# EAGLE design PygmyWEB_Performance_V1p2 (EAGLE 5.10)

## Sheet 1 of 6
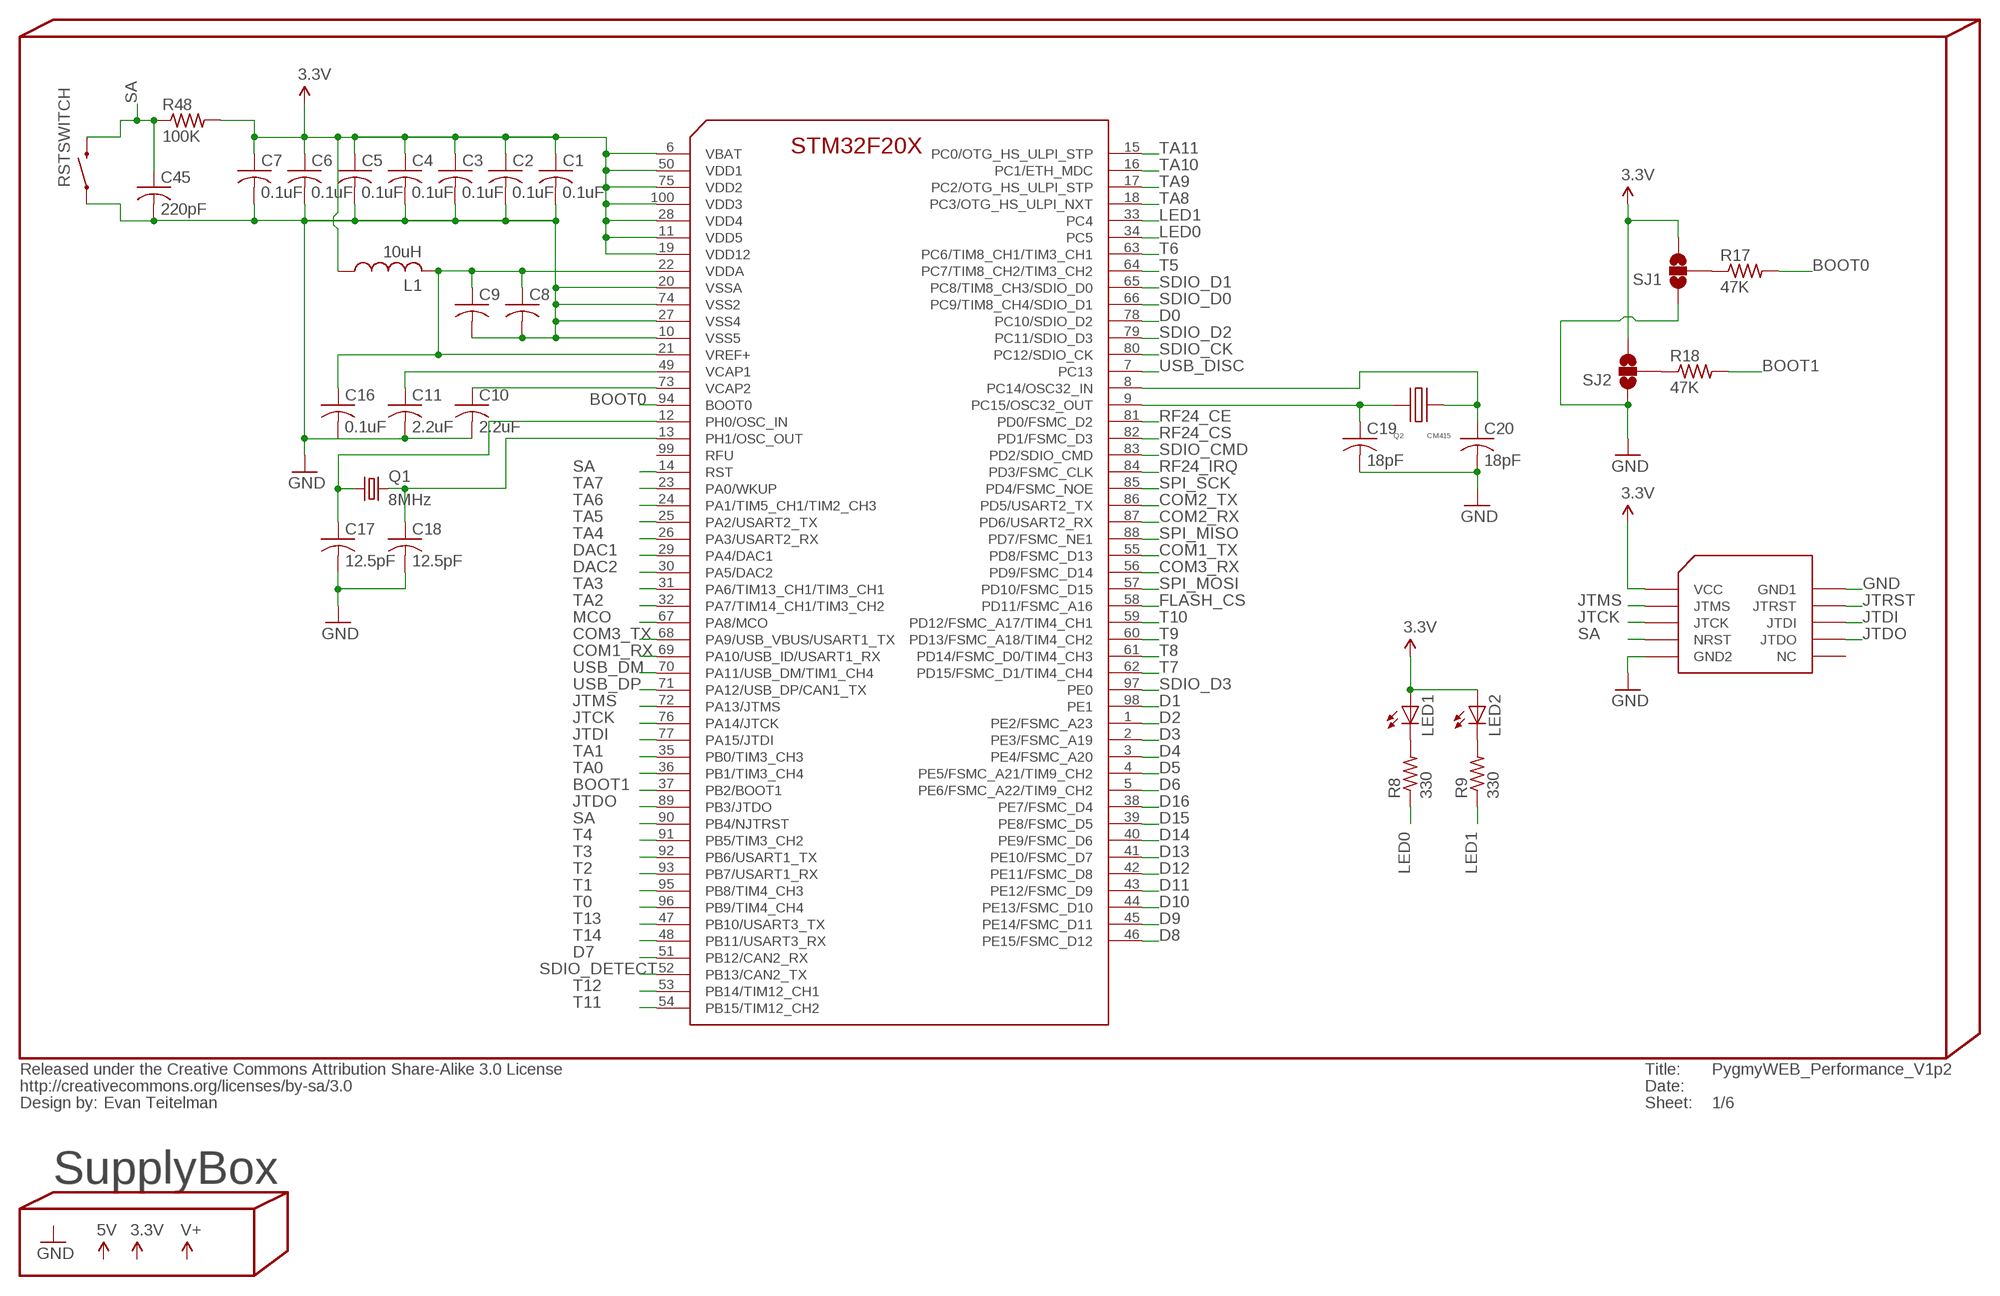
[diagram p0: schematic, sheet 1]

### Parts
C1  0.1uF  C-USC0402  [C0402]
C2  0.1uF  C-USC0402  [C0402]
C3  0.1uF  C-USC0402  [C0402]
C4  0.1uF  C-USC0402  [C0402]
C5  0.1uF  C-USC0402  [C0402]
C6  0.1uF  C-USC0402  [C0402]
C7  0.1uF  C-USC0402  [C0402]
C8  C-USC0402  [C0402]
C9  C-USC0402  [C0402]
C10  2.2uF  C-USC0402  [C0402]
C11  2.2uF  C-USC0402  [C0402]
C16  0.1uF  C-USC0402  [C0402]
C17  12.5pF  C-USC0402  [C0402]
C18  12.5pF  C-USC0402  [C0402]
C19  18pF  C-USC0402  [C0402]
C20  18pF  C-USC0402  [C0402]
C45  220pF  C-USC0402  [C0402]
CC1  Evan Teitelman  CC-BY-SA  [CC-BY-SA]
L1  10uH  L-USL1812  [L1812]
LED1  LED0603  [LED-0603]
LED2  LED0603  [LED-0603]
Q1  8MHz  CRYSTAL5X3  [CRYSTAL-SMD-5X3]
Q2  CM415  [CM415]
R8  330  R-US_R0402  [R0402]
R9  330  R-US_R0402  [R0402]
R17  47K  R-US_R0402  [R0402]
R18  47K  R-US_R0402  [R0402]
R48  100K  R-US_R0402  [R0402]
RSTSWITCH  SWITCH-MOMENTARY-2SMD  [TACTILE_SWITCH_SMD]
SJ1  SOLDERJUMPER_2WAYS  [SJ_3]
SJ2  SOLDERJUMPER_2WAYS  [SJ_3]
U1  STM32F205VG  [TQFP100]
U5  STM32-JTAG-10P  [STM32-JTAG-10P]

### Nets
3.3V: C1.1 C2.1 C3.1 C4.1 C5.1 C6.1 C7.1 L1.1 LED1.A LED2.A R48.2 SJ1.3 SJ2.3 U1.6(VBAT) U1.11(VDD5) U1.19(VDD12) U1.28(VDD4) U1.50(VDD1) U1.75(VDD2) U1.100(VDD3) U5.P$1(VCC) ; also sheet 2,3,4,5
BOOT0: R17.2 U1.94(BOOT0) ; also sheet 3
BOOT1: R18.2 U1.37(PB2/BOOT1) ; also sheet 3
COM1_RX: U1.69(PA10/USB_ID/USART1_RX) ; also sheet 3
COM1_TX: U1.55(PD8/FSMC_D13) ; also sheet 3
COM2_RX: U1.87(PD6/USART2_RX) ; also sheet 3
COM2_TX: U1.86(PD5/USART2_TX) ; also sheet 3
COM3_RX: U1.56(PD9/FSMC_D14) ; also sheet 3
COM3_TX: U1.68(PA9/USB_VBUS/USART1_TX) ; also sheet 3
D0: U1.78(PC10/SDIO_D2) ; also sheet 3
D1: U1.98(PE1) ; also sheet 3
D2: U1.1(PE2/FSMC_A23) ; also sheet 3
D3: U1.2(PE3/FSMC_A19) ; also sheet 3
D4: U1.3(PE4/FSMC_A20) ; also sheet 3
D5: U1.4(PE5/FSMC_A21/TIM9_CH2) ; also sheet 3
D6: U1.5(PE6/FSMC_A22/TIM9_CH2) ; also sheet 3
D7: U1.51(PB12/CAN2_RX) ; also sheet 3
D8: U1.46(PE15/FSMC_D12) ; also sheet 3
D9: U1.45(PE14/FSMC_D11) ; also sheet 3
D10: U1.44(PE13/FSMC_D10) ; also sheet 3
D11: U1.43(PE12/FSMC_D9) ; also sheet 3
D12: U1.42(PE11/FSMC_D8) ; also sheet 3
D13: U1.41(PE10/FSMC_D7) ; also sheet 3
D14: U1.40(PE9/FSMC_D6) ; also sheet 3
D15: U1.39(PE8/FSMC_D5) ; also sheet 3
D16: U1.38(PE7/FSMC_D4) ; also sheet 3
DAC1: U1.29(PA4/DAC1) ; also sheet 3
DAC2: U1.30(PA5/DAC2) ; also sheet 3
FLASH_CS: U1.58(PD11/FSMC_A16)
GND: C1.2 C2.2 C3.2 C4.2 C5.2 C6.2 C7.2 C8.2 C9.2 C10.2 C11.2 C16.2 C17.2 C18.2 C19.2 C20.2 C45.2 RSTSWITCH.1 SJ1.1 SJ2.1 U1.10(VSS5) U1.20(VSSA) U1.27(VSS4) U1.74(VSS2) U5.P$2(GND1) U5.P$9(GND2) ; also sheet 2,3,4,5
JTCK: U1.76(PA14/JTCK) U5.P$5(JTCK) ; also sheet 3
JTDI: U1.77(PA15/JTDI) U5.P$6(JTDI) ; also sheet 3
JTDO: U1.89(PB3/JTDO) U5.P$8(JTDO) ; also sheet 3
JTMS: U1.72(PA13/JTMS) U5.P$3(JTMS) ; also sheet 3
JTRST: U5.P$4(JTRST) ; also sheet 3
LED0: R8.1 U1.34(PC5)
LED1: R9.1 U1.33(PC4)
MCO: U1.67(PA8/MCO) ; also sheet 3
N$1: C17.1 Q1.1 U1.12(PH0/OSC_IN)
N$2: C8.1 C9.1 C16.1 L1.2 U1.21(VREF+) U1.22(VDDA)
N$3: C18.1 Q1.3 U1.13(PH1/OSC_OUT)
N$6: C11.1 U1.49(VCAP1)
N$7: C10.1 U1.73(VCAP2)
N$8: C20.1 Q2.P$2(XOUT) U1.8(PC14/OSC32_IN)
N$9: C19.1 Q2.P$1(XIN) U1.9(PC15/OSC32_OUT)
N$10: LED1.C R8.2
N$12: LED2.C R9.2
N$30: R17.1 SJ1.2
N$31: R18.1 SJ2.2
RF24_CE: U1.81(PD0/FSMC_D2) ; also sheet 2
RF24_CS: U1.82(PD1/FSMC_D3) ; also sheet 2
RF24_IRQ: U1.84(PD3/FSMC_CLK) ; also sheet 2
SA: C45.1 R48.1 RSTSWITCH.3 U1.14(RST) U1.90(PB4/NJTRST) U5.P$7(NRST) ; also sheet 3
SDIO_CK: U1.80(PC12/SDIO_CK)
SDIO_CMD: U1.83(PD2/SDIO_CMD) ; also sheet 4
SDIO_D0: U1.66(PC9/TIM8_CH4/SDIO_D1) ; also sheet 4
SDIO_D1: U1.65(PC8/TIM8_CH3/SDIO_D0) ; also sheet 4
SDIO_D2: U1.79(PC11/SDIO_D3) ; also sheet 4
SDIO_D3: U1.97(PE0) ; also sheet 4
SDIO_DETECT: U1.52(PB13/CAN2_TX) ; also sheet 4
SPI_MISO: U1.88(PD7/FSMC_NE1) ; also sheet 2
SPI_MOSI: U1.57(PD10/FSMC_D15) ; also sheet 2
SPI_SCK: U1.85(PD4/FSMC_NOE) ; also sheet 2
T0: U1.96(PB9/TIM4_CH4) ; also sheet 3
T1: U1.95(PB8/TIM4_CH3) ; also sheet 3
T2: U1.93(PB7/USART1_RX) ; also sheet 3
T3: U1.92(PB6/USART1_TX) ; also sheet 3
T4: U1.91(PB5/TIM3_CH2) ; also sheet 3
T5: U1.64(PC7/TIM8_CH2/TIM3_CH2) ; also sheet 3
T6: U1.63(PC6/TIM8_CH1/TIM3_CH1) ; also sheet 3
T7: U1.62(PD15/FSMC_D1/TIM4_CH4) ; also sheet 3
T8: U1.61(PD14/FSMC_D0/TIM4_CH3) ; also sheet 3
T9: U1.60(PD13/FSMC_A18/TIM4_CH2) ; also sheet 3
T10: U1.59(PD12/FSMC_A17/TIM4_CH1) ; also sheet 3
T11: U1.54(PB15/TIM12_CH2) ; also sheet 3
T12: U1.53(PB14/TIM12_CH1) ; also sheet 3
T13: U1.47(PB10/USART3_TX) ; also sheet 3
T14: U1.48(PB11/USART3_RX) ; also sheet 3
TA0: U1.36(PB1/TIM3_CH4) ; also sheet 3
TA1: U1.35(PB0/TIM3_CH3) ; also sheet 3
TA2: U1.32(PA7/TIM14_CH1/TIM3_CH2) ; also sheet 3
TA3: U1.31(PA6/TIM13_CH1/TIM3_CH1) ; also sheet 3
TA4: U1.26(PA3/USART2_RX) ; also sheet 3
TA5: U1.25(PA2/USART2_TX) ; also sheet 3
TA6: U1.24(PA1/TIM5_CH1/TIM2_CH3) ; also sheet 3
TA7: U1.23(PA0/WKUP) ; also sheet 3
TA8: U1.18(PC3/OTG_HS_ULPI_NXT) ; also sheet 3
TA9: U1.17(PC2/OTG_HS_ULPI_STP) ; also sheet 3
TA10: U1.16(PC1/ETH_MDC) ; also sheet 3
TA11: U1.15(PC0/OTG_HS_ULPI_STP) ; also sheet 3
USB_DISC: U1.7(PC13) ; also sheet 3,4
USB_DM: U1.70(PA11/USB_DM/TIM1_CH4) ; also sheet 3,4
USB_DP: U1.71(PA12/USB_DP/CAN1_TX) ; also sheet 3,4
Unconnected: U1.99(RFU) U5.P$10(NC)

### Notes on the sheet
- SupplyBox

## Sheet 2 of 6
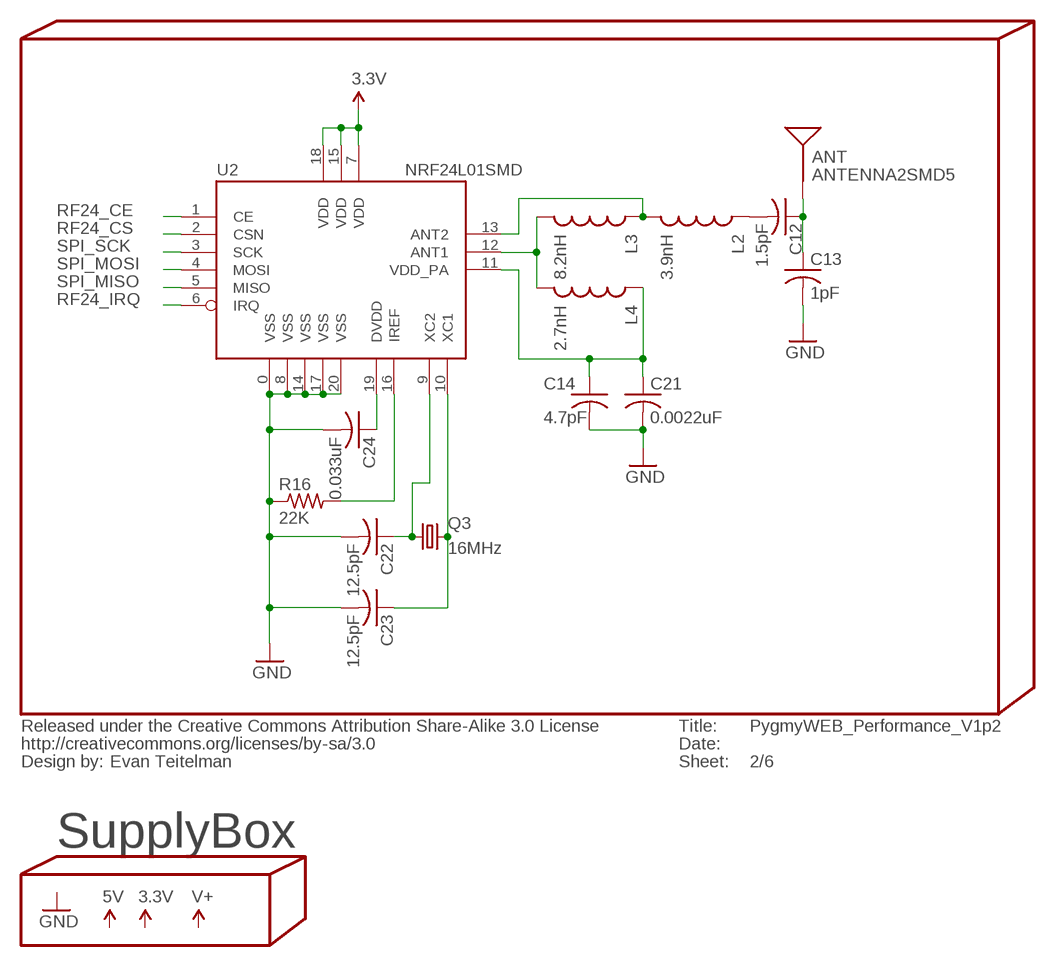
[diagram p1: schematic, sheet 2]

### Parts
ANT  ANTENNA2SMD5  [ANTENNA-CHIP5]
C12  1.5pF  C-USC0402  [C0402]
C13  1pF  C-USC0402  [C0402]
C14  4.7pF  C-USC0402  [C0402]
C21  0.0022uF  C-USC0402  [C0402]
C22  12.5pF  C-USC0402  [C0402]
C23  12.5pF  C-USC0402  [C0402]
C24  0.033uF  C-USC0402  [C0402]
L2  3.9nH  INDUCTOR0603  [0603]
L3  8.2nH  INDUCTOR0603  [0603]
L4  2.7nH  INDUCTOR0603  [0603]
Q3  16MHz  CRYSTAL5X3  [CRYSTAL-SMD-5X3]
R16  22K  R-US_R0402  [R0402]
U2  NRF24L01SMD  [QFN20]

### Nets
3.3V: U2.7(VDD) U2.15(VDD) U2.18(VDD) ; also sheet 1,3,4,5
GND: C13.2 C14.2 C21.2 C22.2 C23.2 C24.2 R16.1 U2.0(VSS) U2.8(VSS) U2.14(VSS) U2.17(VSS) U2.20(VSS) ; also sheet 1,3,4,5
N$17: C12.2 L2.1
N$18: L3.2 L4.2 U2.12(ANT1)
N$19: ANT.FEED(SIGNAL) C12.1 C13.1
N$20: L2.2 L3.1 U2.13(ANT2)
N$21: C14.1 C21.1 L4.1 U2.11(VDD_PA)
N$23: R16.2 U2.16(IREF)
N$24: C24.1 U2.19(DVDD)
N$26: C22.1 Q3.1 U2.9(XC2)
N$27: C23.1 Q3.3 U2.10(XC1)
RF24_CE: U2.1(CE) ; also sheet 1
RF24_CS: U2.2(CSN) ; also sheet 1
RF24_IRQ: U2.6(IRQ) ; also sheet 1
SPI_MISO: U2.5(MISO) ; also sheet 1
SPI_MOSI: U2.4(MOSI) ; also sheet 1
SPI_SCK: U2.3(SCK) ; also sheet 1

### Notes on the sheet
- SupplyBox

## Sheet 3 of 6
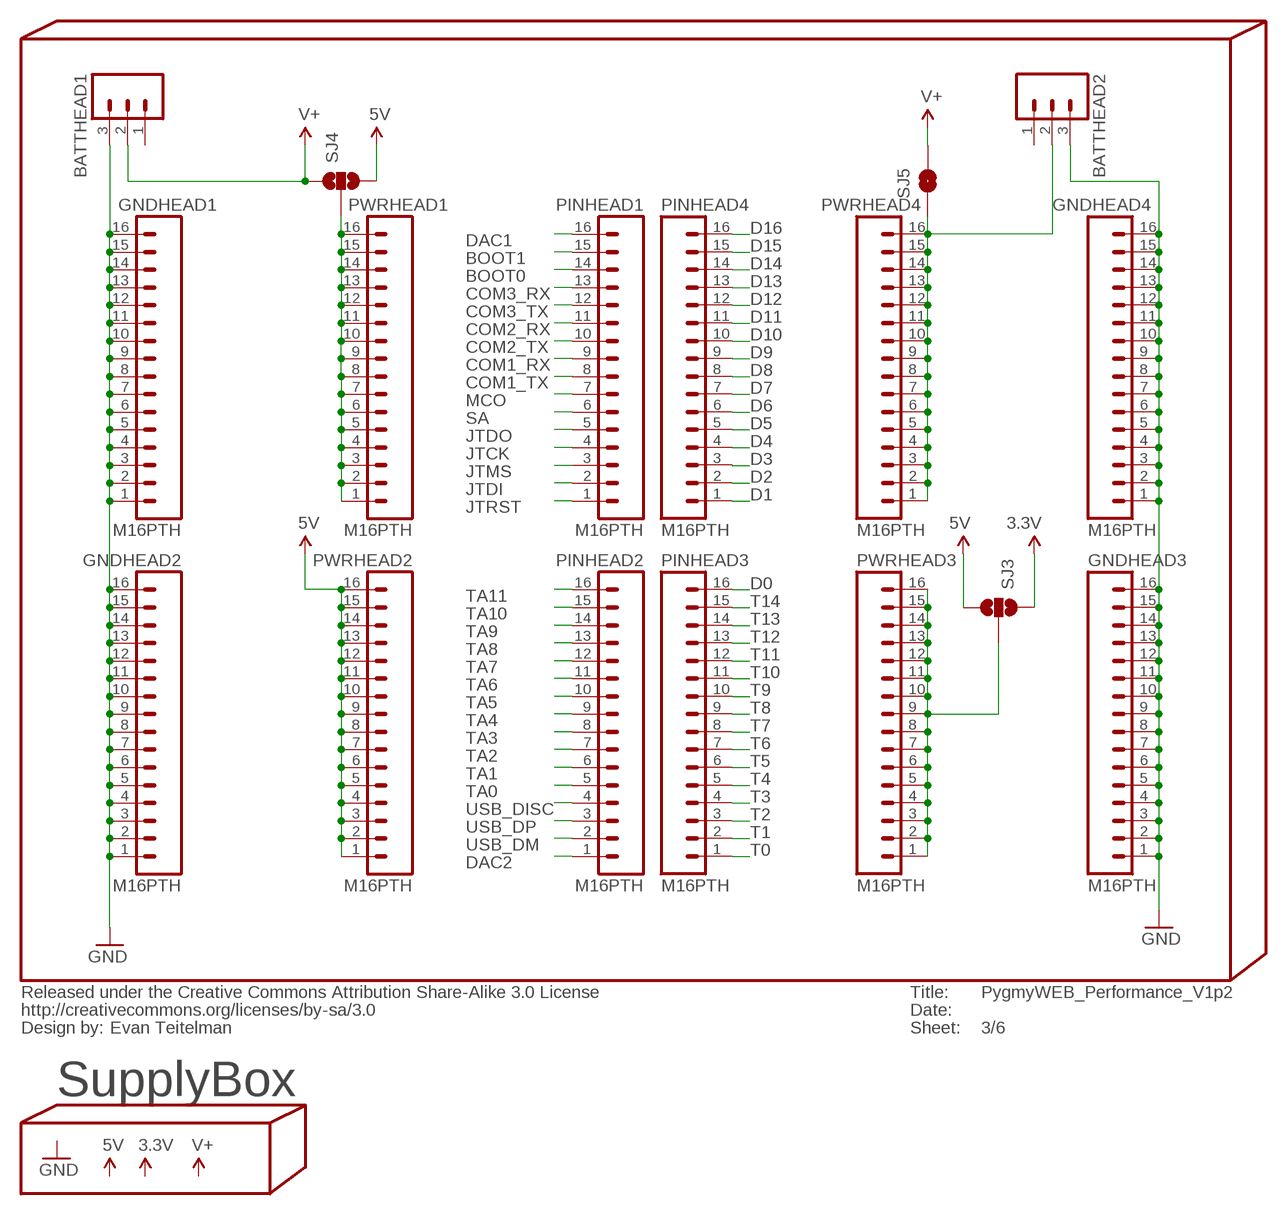
[diagram p2: schematic, sheet 3]

### Parts
BATTHEAD1  M03PTH  [1X03]
BATTHEAD2  M03PTH  [1X03]
GNDHEAD1  M16PTH  [1X16]
GNDHEAD2  M16PTH  [1X16]
GNDHEAD3  M16PTH  [1X16]
GNDHEAD4  M16PTH  [1X16]
PINHEAD1  M16PTH  [1X16]
PINHEAD2  M16PTH  [1X16]
PINHEAD3  M16PTH  [1X16]
PINHEAD4  M16PTH  [1X16]
PWRHEAD1  M16PTH  [1X16]
PWRHEAD2  M16PTH  [1X16]
PWRHEAD3  M16PTH  [1X16]
PWRHEAD4  M16PTH  [1X16]
SJ3  SOLDERJUMPER_2WAYPASTE1&2  [SJ_3_PASTE1&2]
SJ4  SOLDERJUMPER_2WAYPASTE1&2  [SJ_3_PASTE1&2]
SJ5  SOLDERJUMPERNC  [SJ_2S]

### Nets
3.3V: SJ3.1 ; also sheet 1,2,4,5
5V: PWRHEAD2.1 PWRHEAD2.2 PWRHEAD2.3 PWRHEAD2.4 PWRHEAD2.5 PWRHEAD2.6 PWRHEAD2.7 PWRHEAD2.8 PWRHEAD2.9 PWRHEAD2.10 PWRHEAD2.11 PWRHEAD2.12 PWRHEAD2.13 PWRHEAD2.14 PWRHEAD2.15 PWRHEAD2.16 SJ3.3 SJ4.3 ; also sheet 4,5
BOOT0: PINHEAD1.14 ; also sheet 1
BOOT1: PINHEAD1.15 ; also sheet 1
COM1_RX: PINHEAD1.9 ; also sheet 1
COM1_TX: PINHEAD1.8 ; also sheet 1
COM2_RX: PINHEAD1.11 ; also sheet 1
COM2_TX: PINHEAD1.10 ; also sheet 1
COM3_RX: PINHEAD1.13 ; also sheet 1
COM3_TX: PINHEAD1.12 ; also sheet 1
D0: PINHEAD3.16 ; also sheet 1
D1: PINHEAD4.1 ; also sheet 1
D2: PINHEAD4.2 ; also sheet 1
D3: PINHEAD4.3 ; also sheet 1
D4: PINHEAD4.4 ; also sheet 1
D5: PINHEAD4.5 ; also sheet 1
D6: PINHEAD4.6 ; also sheet 1
D7: PINHEAD4.7 ; also sheet 1
D8: PINHEAD4.8 ; also sheet 1
D9: PINHEAD4.9 ; also sheet 1
D10: PINHEAD4.10 ; also sheet 1
D11: PINHEAD4.11 ; also sheet 1
D12: PINHEAD4.12 ; also sheet 1
D13: PINHEAD4.13 ; also sheet 1
D14: PINHEAD4.14 ; also sheet 1
D15: PINHEAD4.15 ; also sheet 1
D16: PINHEAD4.16 ; also sheet 1
DAC1: PINHEAD1.16 ; also sheet 1
DAC2: PINHEAD2.1 ; also sheet 1
GND: BATTHEAD1.3 BATTHEAD2.3 GNDHEAD1.1 GNDHEAD1.2 GNDHEAD1.3 GNDHEAD1.4 GNDHEAD1.5 GNDHEAD1.6 GNDHEAD1.7 GNDHEAD1.8 GNDHEAD1.9 GNDHEAD1.10 GNDHEAD1.11 GNDHEAD1.12 GNDHEAD1.13 GNDHEAD1.14 GNDHEAD1.15 GNDHEAD1.16 GNDHEAD2.1 GNDHEAD2.2 GNDHEAD2.3 GNDHEAD2.4 GNDHEAD2.5 GNDHEAD2.6 GNDHEAD2.7 GNDHEAD2.8 GNDHEAD2.9 GNDHEAD2.10 GNDHEAD2.11 GNDHEAD2.12 GNDHEAD2.13 GNDHEAD2.14 GNDHEAD2.15 GNDHEAD2.16 GNDHEAD3.1 GNDHEAD3.2 GNDHEAD3.3 GNDHEAD3.4 GNDHEAD3.5 GNDHEAD3.6 GNDHEAD3.7 GNDHEAD3.8 GNDHEAD3.9 GNDHEAD3.10 GNDHEAD3.11 GNDHEAD3.12 GNDHEAD3.13 GNDHEAD3.14 GNDHEAD3.15 GNDHEAD3.16 GNDHEAD4.1 GNDHEAD4.2 GNDHEAD4.3 GNDHEAD4.4 GNDHEAD4.5 GNDHEAD4.6 GNDHEAD4.7 GNDHEAD4.8 GNDHEAD4.9 GNDHEAD4.10 GNDHEAD4.11 GNDHEAD4.12 GNDHEAD4.13 GNDHEAD4.14 GNDHEAD4.15 GNDHEAD4.16 ; also sheet 1,2,4,5
JTCK: PINHEAD1.4 ; also sheet 1
JTDI: PINHEAD1.2 ; also sheet 1
JTDO: PINHEAD1.5 ; also sheet 1
JTMS: PINHEAD1.3 ; also sheet 1
JTRST: PINHEAD1.1 ; also sheet 1
MCO: PINHEAD1.7 ; also sheet 1
PH1LINE: PWRHEAD1.1 PWRHEAD1.2 PWRHEAD1.3 PWRHEAD1.4 PWRHEAD1.5 PWRHEAD1.6 PWRHEAD1.7 PWRHEAD1.8 PWRHEAD1.9 PWRHEAD1.10 PWRHEAD1.11 PWRHEAD1.12 PWRHEAD1.13 PWRHEAD1.14 PWRHEAD1.15 PWRHEAD1.16 SJ4.2
PH3LINE: PWRHEAD3.1 PWRHEAD3.2 PWRHEAD3.3 PWRHEAD3.4 PWRHEAD3.5 PWRHEAD3.6 PWRHEAD3.7 PWRHEAD3.8 PWRHEAD3.9 PWRHEAD3.10 PWRHEAD3.11 PWRHEAD3.12 PWRHEAD3.13 PWRHEAD3.14 PWRHEAD3.15 PWRHEAD3.16 SJ3.2
PH4LINE: BATTHEAD2.2 PWRHEAD4.1 PWRHEAD4.2 PWRHEAD4.3 PWRHEAD4.4 PWRHEAD4.5 PWRHEAD4.6 PWRHEAD4.7 PWRHEAD4.8 PWRHEAD4.9 PWRHEAD4.10 PWRHEAD4.11 PWRHEAD4.12 PWRHEAD4.13 PWRHEAD4.14 PWRHEAD4.15 PWRHEAD4.16 SJ5.1
SA: PINHEAD1.6 ; also sheet 1
T0: PINHEAD3.1 ; also sheet 1
T1: PINHEAD3.2 ; also sheet 1
T2: PINHEAD3.3 ; also sheet 1
T3: PINHEAD3.4 ; also sheet 1
T4: PINHEAD3.5 ; also sheet 1
T5: PINHEAD3.6 ; also sheet 1
T6: PINHEAD3.7 ; also sheet 1
T7: PINHEAD3.8 ; also sheet 1
T8: PINHEAD3.9 ; also sheet 1
T9: PINHEAD3.10 ; also sheet 1
T10: PINHEAD3.11 ; also sheet 1
T11: PINHEAD3.12 ; also sheet 1
T12: PINHEAD3.13 ; also sheet 1
T13: PINHEAD3.14 ; also sheet 1
T14: PINHEAD3.15 ; also sheet 1
TA0: PINHEAD2.5 ; also sheet 1
TA1: PINHEAD2.6 ; also sheet 1
TA2: PINHEAD2.7 ; also sheet 1
TA3: PINHEAD2.8 ; also sheet 1
TA4: PINHEAD2.9 ; also sheet 1
TA5: PINHEAD2.10 ; also sheet 1
TA6: PINHEAD2.11 ; also sheet 1
TA7: PINHEAD2.12 ; also sheet 1
TA8: PINHEAD2.13 ; also sheet 1
TA9: PINHEAD2.14 ; also sheet 1
TA10: PINHEAD2.15 ; also sheet 1
TA11: PINHEAD2.16 ; also sheet 1
USB_DISC: PINHEAD2.4 ; also sheet 1,4
USB_DM: PINHEAD2.2 ; also sheet 1,4
USB_DP: PINHEAD2.3 ; also sheet 1,4
V+: BATTHEAD1.2 SJ4.1 SJ5.2 ; also sheet 5
Unconnected: BATTHEAD1.1 BATTHEAD2.1

### Notes on the sheet
- SupplyBox

## Sheet 4 of 6
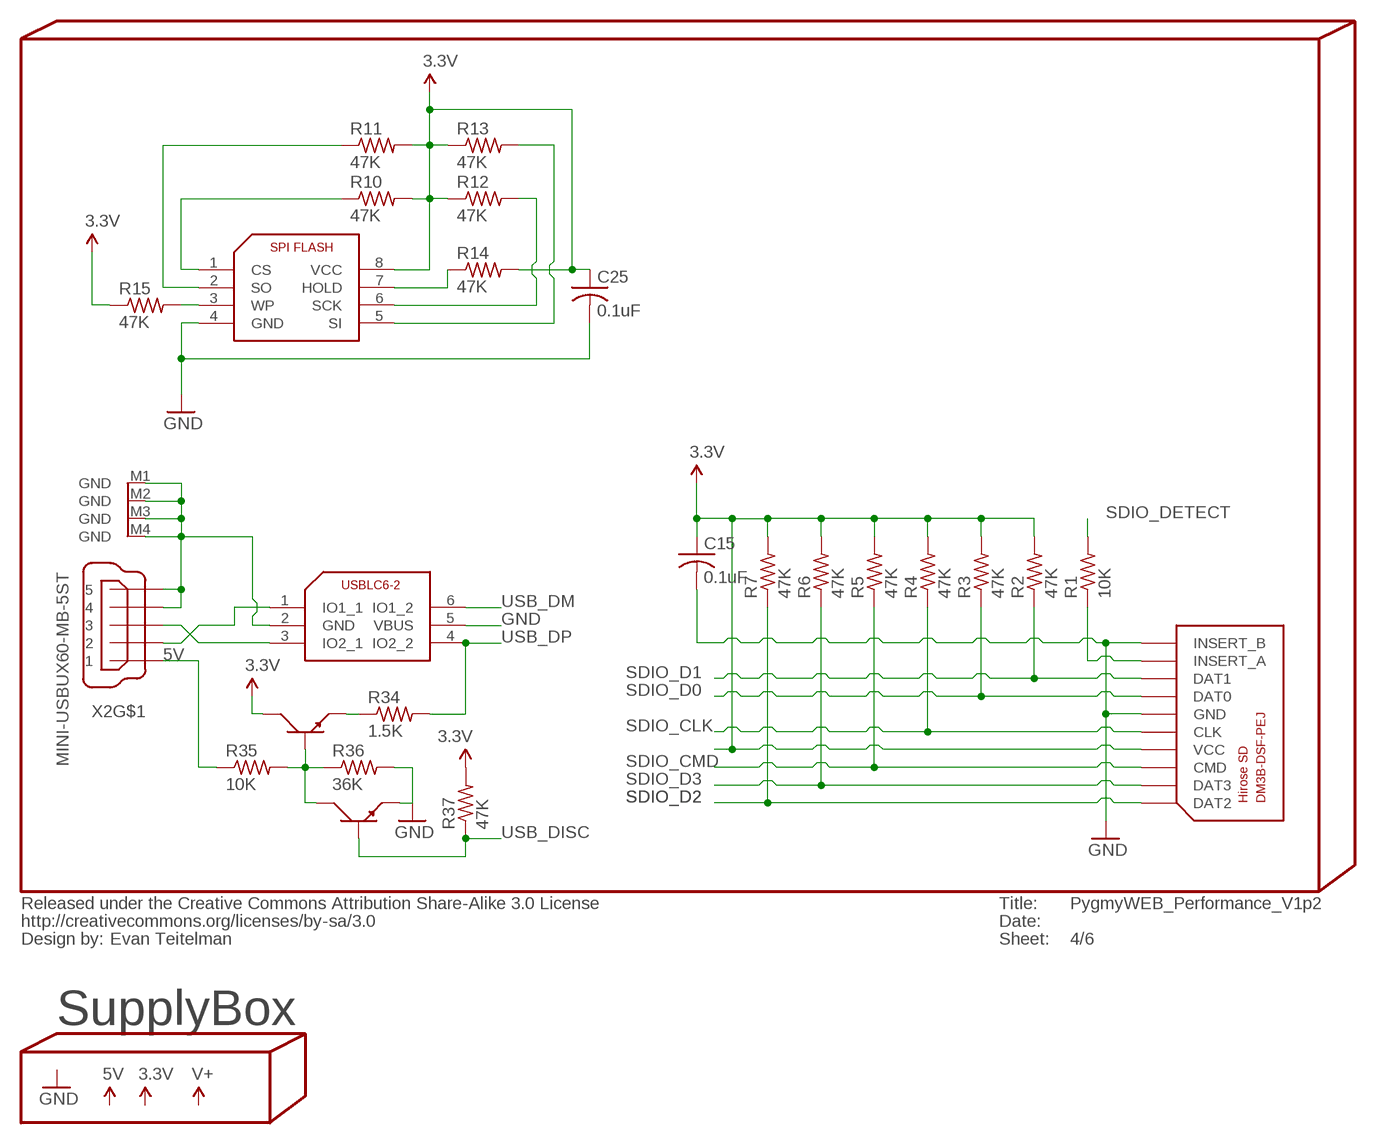
[diagram p3: schematic, sheet 4]

### Parts
C15  0.1uF  C-USC0402  [C0402]
C25  0.1uF  C-USC0402  [C0402]
R1  10K  R-US_R0402  [R0402]
R2  47K  R-US_R0402  [R0402]
R3  47K  R-US_R0402  [R0402]
R4  47K  R-US_R0402  [R0402]
R5  47K  R-US_R0402  [R0402]
R6  47K  R-US_R0402  [R0402]
R7  47K  R-US_R0402  [R0402]
R10  47K  R-US_R0402  [R0402]
R11  47K  R-US_R0402  [R0402]
R12  47K  R-US_R0402  [R0402]
R13  47K  R-US_R0402  [R0402]
R14  47K  R-US_R0402  [R0402]
R15  47K  R-US_R0402  [R0402]
R34  1.5K  R-US_R0402  [R0402]
R35  10K  R-US_R0402  [R0402]
R36  36K  R-US_R0402  [R0402]
R37  47K  R-US_R0402  [R0402]
U3  SST25VF080B  [DUBLIB_SOIC8]
U4  USBLC6-2  [SOT23-6L]
U6  HIROSE-SDCARD-DM3B-DSF-PEJ  [HIROSE-SDCARD-DM3B-DSF-PEJ]
U$23  PMBT6428  [SOT23]
U$24  PMBT6428  [SOT23]
X2  MINI-USBUX60-MB-5ST  [DUBLIB_UX60-MB-5ST]

### Nets
3.3V: C15.1 C25.1 R2.2 R3.2 R4.2 R5.2 R6.2 R7.2 R10.2 R11.2 R12.1 R13.1 R14.2 R15.1 R37.2 U3.8(VCC) U6.P$4(VCC) U$23.3 ; also sheet 1,2,3,5
5V: R35.1 X2.1 ; also sheet 3,5
GND: C15.2 C25.2 R36.2 U3.4(GND) U4.2(GND) U4.5(VBUS) U6.P$6(GND) U6.P$11(INSERT_B) U$24.2 X2.4 X2.5 X2.M1(GND) X2.M2(GND) X2.M3(GND) X2.M4(GND) ; also sheet 1,2,3,5
N$4: R35.2 R36.1 U$23.1 U$24.3
N$11: R1.1 U6.P$9(INSERT_A)
N$13: R10.1 U3.1(CS)
N$14: R11.1 U3.2(SO)
N$15: R12.2 U3.6(SCK)
N$16: R13.2 U3.5(SI)
N$25: R34.1 U$23.2
N$28: R15.2 U3.3(WP)
N$29: R14.1 U3.7(HOLD)
N$38: U4.1(IO1_1) X2.2
SDIO_CLK: R4.1 U6.P$5(CLK)
SDIO_CMD: R5.1 U6.P$3(CMD) ; also sheet 1
SDIO_D0: R3.1 U6.P$7(DAT0) ; also sheet 1
SDIO_D1: R2.1 U6.P$8(DAT1) ; also sheet 1
SDIO_D2: R7.1 U6.P$1(DAT2) ; also sheet 1
SDIO_D3: R6.1 U6.P$2(DAT3) ; also sheet 1
SDIO_DETECT: R1.2 ; also sheet 1
USB_DISC: R37.1 U$24.1 ; also sheet 1,3
USB_DM: U4.6(IO1_2) ; also sheet 1,3
USB_DP: R34.2 U4.4(IO2_2) ; also sheet 1,3
USBP3: U4.3(IO2_1) X2.3

### Notes on the sheet
- SupplyBox

## Sheet 5 of 6
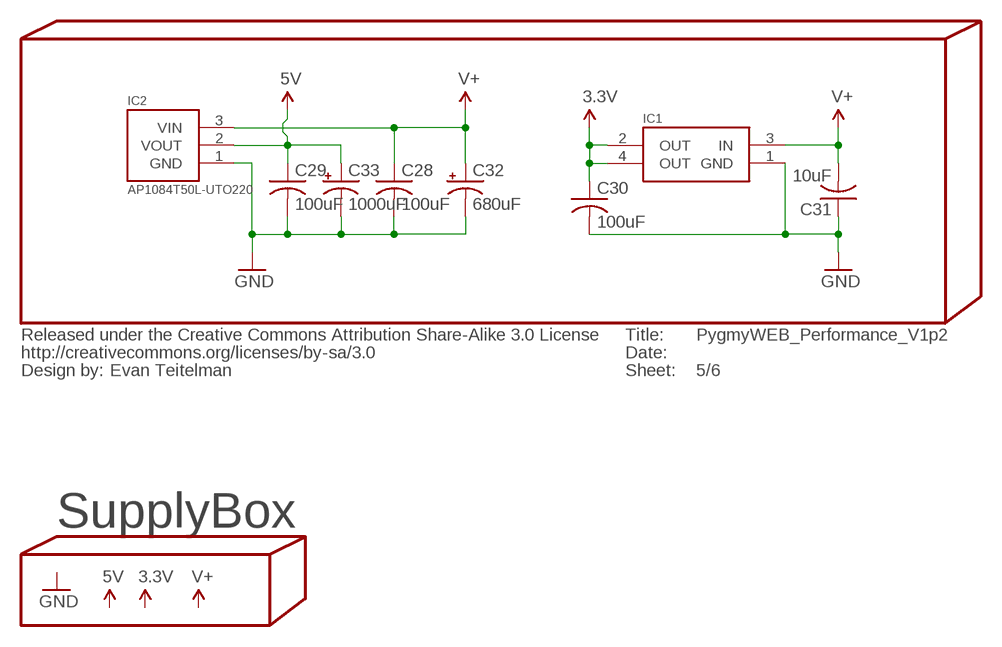
[diagram p4: schematic, sheet 5]

### Parts
C28  100uF  C-USC0402  [C0402]
C29  100uF  C-USC0402  [C0402]
C30  100uF  C-USC0402  [C0402]
C31  10uF  C-USC0402  [C0402]
C32  680uF  CAP_POLG  [PANASONIC_G]
C33  1000uF  CAP_POLG  [PANASONIC_G]
IC1  TLV111  [SOT223]
IC2  AP1084T50L-UTO220  [TO220V]

### Nets
3.3V: C30.1 IC1.2(OUT) IC1.4(OUT) ; also sheet 1,2,3,4
5V: C29.1 C33.+ IC2.2(VOUT) ; also sheet 3,4
GND: C28.2 C29.2 C30.2 C31.1 C32.- C33.- IC1.1(GND) IC2.1(GND) ; also sheet 1,2,3,4
V+: C28.1 C31.2 C32.+ IC1.3(IN) IC2.3(VIN) ; also sheet 3

### Notes on the sheet
- SupplyBox

## Sheet 6 of 6
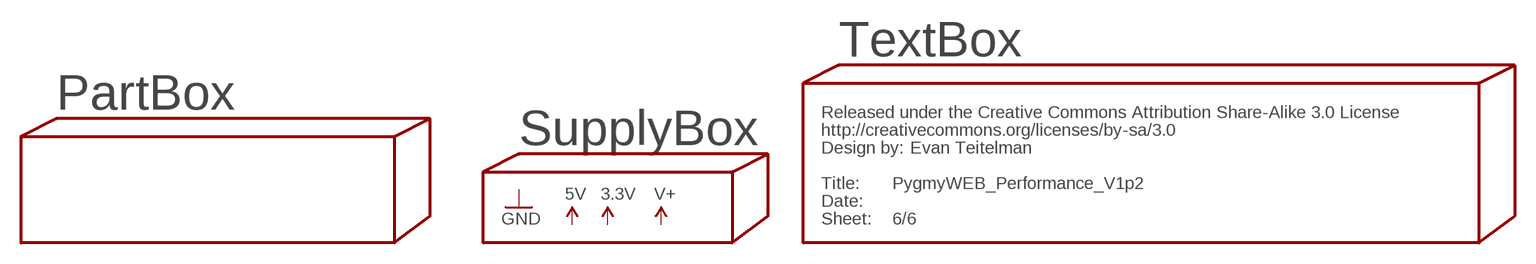
[diagram p5: schematic, sheet 6]

### Notes on the sheet
- TextBox
- PartBox
- SupplyBox

## Power pins joined to a net without a drawn wire
GND: U6.P$12(GND) U6.P$13(GND) U6.P$14(GND)

## Library data of the parts
ANT = Pygmy:ANTENNA2: Antenna Single endded antenna. Common with smaller chip antennas. CHIP4 package is the GPS Chip Antenna SKU: GPS-08418. CHIP5 package is 2.4GHz chip antenna SKU: WRL-00144.
BATTHEAD1 BATTHEAD2 = SparkFun:M03: Header 3 Standard 3-pin 0.1" header. Use with straight break away headers (SKU : PRT-00116), right angle break away headers (PRT-00553), swiss pins (PRT-00743), machine pins (PRT-00117), and female headers (PRT-00115). Molex polarized connector foot print use with SKU : PRT-08232 with associated crimp pins and housings.
C1-C25 C28-C31 C45 = rcl:C-US: CAPACITOR, American symbol
C32 C33 = SparkFun:CAP_POL: Capacitor Polarized These are standard SMD and PTH capacitors. Normally 10uF, 47uF, and 100uF in electrolytic and tantalum varieties. Always verify the external diameter of the through hole cap, it varies with capacity, voltage, and manufacturer. The EIA devices should be standard.
CC1 = Custom12:CC-BY-SA: Creative Commons Attribution-ShareAlike License <http://creativecommons.org/licenses/by-sa/3.0/>
GNDHEAD1-GNDHEAD4 PINHEAD1-PINHEAD4 PWRHEAD1-PWRHEAD4 = Pygmy:M16
IC1 = Custom12:TLV111
IC2 = Custom12:AP1084T50L-U
L1 = rcl:L-US: INDUCTOR, American symbol
L2-L4 = Pygmy:INDUCTOR: Inductors Basic Inductor/Choke - 0603 and 1206. Footprints are not proven and vary greatly between part numbers.
LED1 LED2 = Pygmy:LED: LEDs Standard schematic elements and footprints for 5mm, 3mm, 1206, and 0603 sized LEDs. 5mm - Spark Fun Electronics SKU : COM-00529 (and others)
Q1 Q3 = Pygmy:CRYSTAL: Crystals Various standard crystals. Proven footprints. Spark Fun Electronics SKU : COM-00534
Q2 = Pygmy:CM415
R1-R18 R34-R37 R48 = rcl:R-US_: RESISTOR, American symbol
RSTSWITCH = SparkFun:SWITCH-MOMENTARY-2
SJ1 SJ2 = Pygmy:SOLDERJUMPER_2WAY: Solder Jumper 2 way solder jumper
SJ3 SJ4 = SparkFun:SOLDERJUMPER_2WAY: Solder Jumper 2 way solder jumper
SJ5 = SparkFun:SOLDERJUMPER: Solder Jumper Standard SMD solder jumper. Used to automate production. Two varients : Normally Open and Normally Closed are the same, but have different paste layers. NC will have a large amount of paste and should jumper during reflow.
U1 = Pygmy:STM32F205VG
U2 = Pygmy:NRF24L01: 2.4GHz Low Power Transceiver This is the very popular, low cost, very low power RF transceiver from Nordic Semiconductor. Simple SPI interface. SKU: COM-00690
U3 = Pygmy:SST25VF080B
U4 = Pygmy:USBLC6-2
U5 = Pygmy:STM32-JTAG-10P
U6 = Pygmy:HIROSE-SDCARD-DM3B-DSF-PEJ
U$23 U$24 = dublib:PMBT6428
X2 = Pygmy:MINI-USB: MINI USB Connector Source: http://www.hirose.co.jp/cataloge_hp/e24000019.pdf

## Board
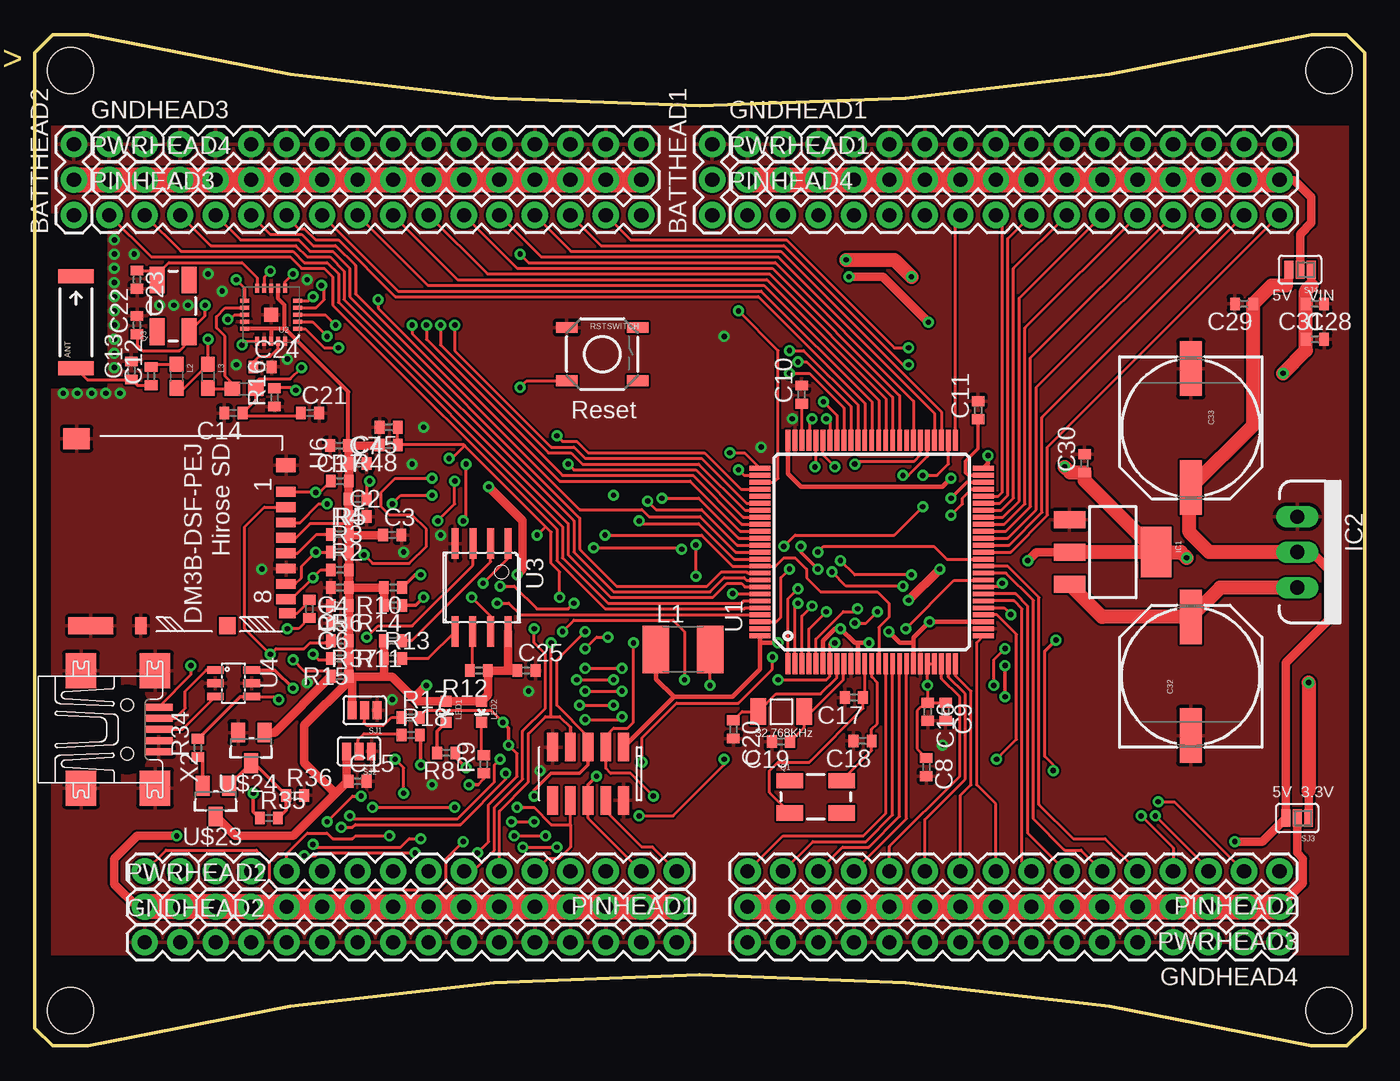
[diagram p6: board, top side]
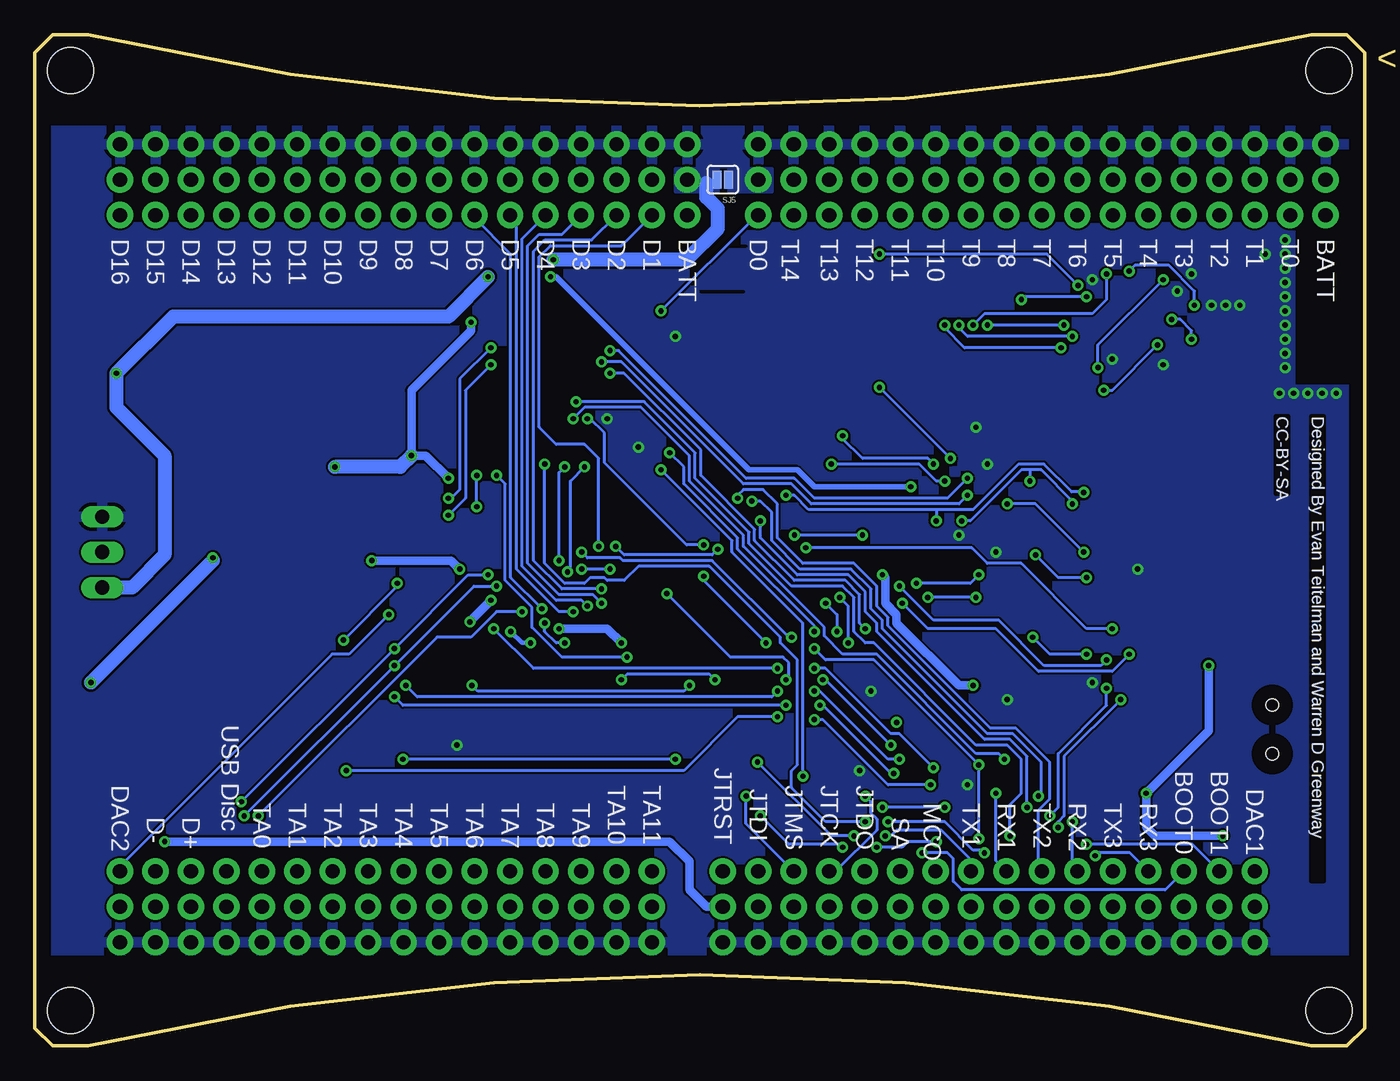
[diagram p7: board, bottom side, seen from below]

Size 95.25 x 72.39 mm. Coordinates in mm from the lower left corner, seen from the top.
Outline: 1.27,0 3.81,0 arc-26 91.44,0 93.98,0 95.25,1.27 95.25,71.12 93.98,72.39 91.44,72.39 arc-26 3.81,72.39 1.27,72.39 0,71.12 0,1.27 1.27,0
Copper layers (1*16): Top 0.035mm / dielectric 1.5mm / Bottom 0.035mm
Design rules "AdvancedCircuits *": minimum track width 6mil, minimum drill 15mil, track to track 6mil, track to pad 6mil, pad to pad 4mil, via to via 6mil, smd to smd 4mil, copper to edge 40mil, drill to drill 8mil, minimum pad ring 10mil, minimum via ring 8mil, stop-mask expansion 4mil, vias tented up to drill 0mil, thermal gap 10mil
tRestrict: 5 lines
bRestrict: 4 lines

### Footprints (pad centres in the part's own frame; a part is rotated, then mirrored left to right if it is on the bottom)
ANTENNA-CHIP5 = smd 1.016 x 2.54: FEED -3.302,0; NC 3.302,0
1X03 = drill 1.016 pad 1.88 round: 1 0,0; 2 2.54,0; 3 5.08,0
C0402 = smd 0.7 x 0.9: 1 -0.65,0; 2 0.65,0
PANASONIC_G = smd 3.9 x 1.6: + 4.25,0; - -4.25,0
1X16 = drill 1.016 pad 1.88 round: 1 0,0; 2 2.54,0; 3 5.08,0; 4 7.62,0; 5 10.16,0; 6 12.7,0; 7 15.24,0; 8 17.78,0; 9 20.32,0; 10 22.86,0; 11 25.4,0; 12 27.94,0; 13 30.48,0; 14 33.02,0; 15 35.56,0; 16 38.1,0
SOT223 = smd 1.219 x 2.235: 1 -2.311,-3.099; 2 0,-3.099; 3 2.311,-3.099 | smd 3.6 x 2.2: 4 0,3.099
TO220V = drill 1.016 long: 1 -2.54,0; 2 0,0; 3 2.54,0
L1812 = smd 1.9 x 3.4: 1 -1.95,0; 2 1.95,0
0603 = smd 1.1 x 1: 1 -0.85,0; 2 0.85,0
LED-0603 = smd 0.8 x 0.8: A 0,-0.75; C 0,0.75
CRYSTAL-SMD-5X3 = smd 1.9 x 1.1: 1 -1.85,-1.15; 2 1.85,-1.15; 3 1.85,1.15; 4 -1.85,1.15
CM415 = smd 1.1 x 1.9: P$1 0,0; P$2 3.3,0
R0402 = smd 0.7 x 0.9: 1 -0.65,0; 2 0.65,0
TACTILE_SWITCH_SMD = smd 1.524 x 0.762: 1 -2.54,1.905; 2 2.54,1.905; 3 -2.54,-1.905; 4 2.54,-1.905
SJ_3 = smd 0.635 x 1.27: 1 -0.889,0; 2 0,0; 3 0.889,0
SJ_3_PASTE1&2 = smd 0.635 x 1.27: 1 -0.813,0; 2 0,0; 3 0.813,0
SJ_2S = smd 0.635 x 1.27: 1 -0.412,0; 2 0.412,0
TQFP100 = smd 1.5 x 0.35: 1 -8,6; 2 -8,5.5; 3 -8,5; 4 -8,4.5; 5 -8,4; 6 -8,3.5; 7 -8,3; 8 -8,2.5; 9 -8,2; 10 -8,1.5; 11 -8,1; 12 -8,0.5; 13 -8,0; 14 -8,-0.5; 15 -8,-1; 16 -8,-1.5; 17 -8,-2; 18 -8,-2.5; 19 -8,-3; 20 -8,-3.5; 21 -8,-4; 22 -8,-4.5; 23 -8,-5; 24 -8,-5.5; 25 -8,-6; 51 8,-6; 52 8,-5.5; 53 8,-5; 54 8,-4.5; 55 8,-4; 56 8,-3.5; 57 8,-3; 58 8,-2.5; 59 8,-2; 60 8,-1.5; 61 8,-1; 62 8,-0.5; 63 8,0; 64 8,0.5; 65 8,1; 66 8,1.5; 67 8,2; 68 8,2.5; 69 8,3; 70 8,3.5; 71 8,4; 72 8,4.5; 73 8,5; 74 8,5.5; 75 8,6 | smd 0.35 x 1.5: 26 -6,-8; 27 -5.5,-8; 28 -5,-8; 29 -4.5,-8; 30 -4,-8; 31 -3.5,-8; 32 -3,-8; 33 -2.5,-8; 34 -2,-8; 35 -1.5,-8; 36 -1,-8; 37 -0.5,-8; 38 0,-8; 39 0.5,-8; 40 1,-8; 41 1.5,-8; 42 2,-8; 43 2.5,-8; 44 3,-8; 45 3.5,-8; 46 4,-8; 47 4.5,-8; 48 5,-8; 49 5.5,-8; 50 6,-8; 76 6,8; 77 5.5,8; 78 5,8; 79 4.5,8; 80 4,8; 81 3.5,8; 82 3,8; 83 2.5,8; 84 2,8; 85 1.5,8; 86 1,8; 87 0.5,8; 88 0,8; 89 -0.5,8; 90 -1,8; 91 -1.5,8; 92 -2,8; 93 -2.5,8; 94 -3,8; 95 -3.5,8; 96 -4,8; 97 -4.5,8; 98 -5,8; 99 -5.5,8; 100 -6,8
QFN20 = smd 1 x 1: 0 0,0 | smd 0.65 x 0.3: 1 -1.9,1; 2 -1.9,0.5; 3 -1.9,0; 4 -1.9,-0.5; 5 -1.9,-1; 11 1.9,-1; 12 1.9,-0.5; 13 1.9,0; 14 1.9,0.5; 15 1.9,1 | smd 0.3 x 0.65: 6 -1,-1.9; 7 -0.5,-1.9; 8 0,-1.9; 9 0.5,-1.9; 10 1,-1.9; 16 1,1.9; 17 0.5,1.9; 18 0,1.9; 19 -0.5,1.9; 20 -1,1.9
DUBLIB_SOIC8 = smd 0.5 x 2.2: 1 -1.905,-3.154; 2 -0.645,-3.154; 3 0.625,-3.154; 4 1.895,-3.154; 5 1.905,3.154; 6 0.635,3.154; 7 -0.635,3.154; 8 -1.905,3.154
SOT23-6L = smd 0.55 x 1.2: 1 -0.95,-1.3; 2 0,-1.3; 3 0.95,-1.3; 4 0.95,1.3; 5 0,1.3; 6 -0.95,1.3
STM32-JTAG-10P = smd 0.762 x 2.032: P$1 0,0; P$2 0,3.81; P$3 1.27,0; P$4 1.27,3.81; P$5 2.54,0; P$6 2.54,3.81; P$7 3.81,0; P$8 3.81,3.81; P$9 5.08,0; P$10 5.08,3.81
HIROSE-SDCARD-DM3B-DSF-PEJ = smd 0.7 x 1.4: P$1 0,-0.7; P$2 1.1,-0.7; P$3 2.2,-0.7; P$4 3.3,-0.7; P$5 4.4,-0.7; P$6 5.5,-0.7; P$7 6.6,-0.7; P$8 7.7,-0.7 | smd 0.7 x 1.2: P$9 8.7,-0.6 | smd 1.2 x 1.2: P$10 9.6,-4.9 | smd 1.2 x 0.8: P$11 9.6,-11.1 | smd 1.2 x 3.2: P$12 9.6,-14.7 | smd 1.5 x 1.9: P$13 -3.8,-15.7 | smd 1 x 1.4: P$14 -1.9,-0.7
STAND-OFF = hole 3.302: 0,0
SOT23@1 = smd 1 x 1.4: 1 -0.95,-1.1; 2 0.95,-1.1; 3 0,1.1
DUBLIB_UX60-MB-5ST = smd 2 x 0.5: 1 2.25,1.6; 2 2.25,0.8; 3 2.25,0; 4 2.25,-0.8; 5 2.25,-1.6 | smd 2.2 x 2.5: M1 -3.3,-4.2; M2 -3.3,4.2; M3 2,4.2; M4 2,-4.2 | hole 0.9: 0,-1.75; 0,1.75

### Placement (x,y rotation side)
ANT  2.95,51.82 90 top
BATTHEAD1  48.51,59.49 90 top
BATTHEAD2  2.79,59.49 90 top
C1  21.79,42.98 180 top
C2  23.11,37.9 0 top
C3  25.6,36.58 0 top
C4  21.84,32.82 180 top
C5  21.84,31.55 180 top
C6  21.84,30.28 180 top
C7  23.11,41.71 0 top
C8  63.86,19.96 270 top
C9  65.23,23.93 270 top
C10  54.91,46.63 90 top
C11  67.56,45.52 90 top
C12  8.33,47.96 90 top
C13  6.91,48.36 90 top
C14  14.22,45.31 180 top
C15  23.11,18.95 0 top
C16  63.96,23.93 270 top
C17  58.67,24.94 180 top
C18  59.28,21.84 180 top
C19  53.44,21.79 180 top
C20  50.04,22.66 270 top
C21  19.71,45.31 0 top
C22  7.32,51.61 90 top
C23  7.32,54.86 270 top
C24  16.31,48.62 0 top
C25  35.2,26.87 0 top
C28  91.69,50.6 0 top
C29  86.61,53.14 180 top
C30  75.18,41.71 90 top
C31  91.69,53.14 180 top
C32  82.8,26.47 90 top
C33  82.8,44.25 270 top
C45  25.35,44.3 180 top
CC1  0.25,-9.09 0 top  (outside the outline)
GNDHEAD1  51.05,64.57 0 top
GNDHEAD2  7.87,7.42 0 top
GNDHEAD3  5.33,64.57 0 top
GNDHEAD4  89.15,7.42 180 top
IC1  77.22,35.36 270 top
IC2  90.42,35.36 270 top
L1  46.43,28.4 0 top
L2  10.16,47.96 270 top
L3  12.4,47.96 270 top
L4  14.99,47.04 180 top
LED1  29.46,23.93 180 top
LED2  32,23.93 180 top
PINHEAD1  45.97,12.5 180 top
PINHEAD2  89.15,12.5 180 top
PINHEAD3  5.33,59.49 0 top
PINHEAD4  51.05,59.49 0 top
PWRHEAD1  51.05,62.03 0 top
PWRHEAD2  7.87,9.96 0 top
PWRHEAD3  89.15,9.96 180 top
PWRHEAD4  5.33,62.03 0 top
Q1  55.93,17.83 0 top
Q2  55.12,23.93 180 top
Q3  9.91,52.98 90 top
R1  19.66,31.29 270 top
R2  21.84,34.09 0 top
R3  21.84,35.36 0 top
R4  21.84,36.63 0 top
R5  23.11,39.17 180 top
R6  21.84,29.01 0 top
R7  21.84,40.44 0 top
R8  29.46,20.98 180 top
R9  32.16,20.17 90 top
R10  25.65,32.82 180 top
R11  25.65,29.01 180 top
R12  31.8,26.87 180 top
R13  25.65,27.74 0 top
R14  25.65,31.55 180 top
R15  21.84,27.74 180 top
R16  17.17,46.43 90 top
R17  26.92,23.52 0 top
R18  26.92,22.25 0 top
R34  11.68,21.34 90 top
R35  16.76,16.31 0 top
R36  18.64,17.93 0 top
R37  21.84,26.47 0 top
R48  25.35,43.03 180 top
RSTSWITCH  40.64,49.53 0 top
SJ1  23.62,24.03 180 top
SJ2  23.22,21.08 180 top
SJ3  90.42,16.31 180 top
SJ4  90.63,55.58 180 top
SJ5  45.97,62.03 180 bottom
U1  59.94,35.36 90 top
U2  16.93,52.35 180 top
U3  32,32.82 180 top
U4  14.22,25.96 270 top
U5  42.16,21.39 180 top
U6  18.69,39.67 270 top
U$10  [STAND-OFF]  92.71,69.85 0 top
U$11  [STAND-OFF]  2.54,69.85 0 top
U$12  [STAND-OFF]  2.54,2.54 0 top
U$13  [STAND-OFF]  92.71,2.54 0 top
U$23  PMBT6428  [SOT23@1]  12.95,17.53 180 top
U$24  PMBT6428  [SOT23@1]  15.49,21.34 180 top
X2  6.6,22.66 0 top

### Tracks (layer width: path | path; a pad name or v marks a point on that pad's centre or on a via)
3.3V  (via drill 0.38)
  Top 0.203: U6.P$4 18.7,36.38 19.71,37.39 22.49,37.39 | 58.93,28.85 58.94,28.84
  Top 0.279: C1.1 22.44,46.82 17.92,51.35 | 17.92,51.35 16.87,51.35 | 16.87,51.35 U2.15 | U2.18 16.93,51.29 16.87,51.35 | U2.7 17.43,53.49 17.88,53.03 17.88,51.38 17.92,51.35
  Top 0.305: IC1.2 73.97,35.36
  Top 0.33: 62.94,28.85 62.94,29.21 v64.09,30.36 U1.28 | 62.94,28.85 U1.19 | U1.75 53.94,40.95 54.86,40.03 65.02,40.03 v65.63,40.64 | L1.1 44.5,28.38 44.5,26.26 45.77,24.99 | 51.94,28.85 51.94,26.95 49.99,24.99 45.77,24.99 | 51.94,28.85 U1.100 | 58.94,28.84 U1.11 | v53.24,28.85 51.94,28.85 | U1.6 56.44,29.01 57.3,29.87 v57.71,29.87 58.73,28.85 58.93,28.85 v59.74,28.85 | v61.16,29.67 61.98,28.85 62.94,28.85 | 45.77,24.99 U5.P$1 | v68.28,42.27 68.28,41.69 U1.50 | 22.4,18.95 22.38,18.95 22.33,18.9
  Top 0.406: U3.8 33.91,30.46
  Top 0.61: R37.2 22.55,26.42 24.79,26.42 | R37.2 R15.1 R6.2 C6.1 C5.1 C4.1 | C4.1 R2.2 R3.2 R4.2 | R4.2 22.49,37.39 22.49,37.87 C2.1 R5.2 22.46,40.41 R7.2 22.49,41.68 C7.1 22.46,42.96 C1.1 24.65,42.98 R48.2 | 79.25,35.36 79.05,35.36 | 22.46,19.01 C15.1 22.4,18.95 21.54,18.09 | R37.2 22.49,26.15 19.3,22.96 19.3,20.28 21.5,18.09 21.54,18.09 | U$23.3 14.34,15.04 18.49,15.04 21.54,18.09 | 73.97,35.36 71.73,35.36 v71.12,34.75 | v64.82,34.14 v62.59,31.9 | C3.1 22.55,36.58 R4.2 | R13.1 24.99,27.73 | R13.1 R11.2 | R14.2 R10.2 C4.1 | v32.51,40.03 34.95,37.59 34.95,34.14 v34.54,33.73 | v58.32,55.07 60.76,55.07 v64.01,51.82 | 22.33,18.86 22.33,18.9 SJ2.3 | SJ1.3 22.73,26.23 R37.2 | U3.8 33.91,27.05 34.09,26.87 | 34.09,26.87 C25.1 | 34.09,26.87 R12.1 32.45,25.12 LED2.A LED1.A 27.34,24.68 27.13,24.89 | 27.13,24.89 25.6,26.42 24.79,26.42 | R13.1 25,26.63 24.79,26.42 | 27.13,24.89 v28.04,25.81 | 91.24,18.29 SJ3.1
  Top 0.813: IC1.4 79.25,35.36
  Top 1.016: 79.25,35.36 IC1.2 | v82.5,34.95 82.09,35.36 IC1.4 75.18,40.49 C30.1 74.16,41.06 v73.76,41.45 | v91.24,26.01 91.24,18.29
  Bottom 0.33: v53.24,28.85 53.44,29.06 | v61.16,29.67 60.35,28.85 v59.74,28.85
  Bottom 0.406: v32.51,40.03 39.42,40.03 40.64,41.25 44.09,41.25 57.91,55.07 v58.32,55.07
  Bottom 0.61: v82.5,34.95 82.5,34.75 | v65.63,40.64 67.26,42.27 v68.28,42.27 68.28,46.94 64.01,51.21 v64.01,51.82 | v64.09,30.36 64.09,30.4 v62.59,31.9 | v64.82,34.14 65.43,34.75 v71.12,34.75 | v57.71,29.87 54.25,29.87 v53.24,28.85 | v34.54,33.73 34.34,33.53 34.34,31.7 33.53,30.89 33.53,30.28 29.06,25.81 v28.04,25.81
  Bottom 1.016: 82.5,34.75 v91.24,26.01 | v73.76,41.45 69.09,41.45 v68.28,42.27
5V  (via drill 0.38)
  Top 0.203: X2.1 11.18,26.58 v11.18,27.23
  Top 0.254: R35.1 15.65,16.77 v15.65,18.09
  Top 0.61: IC2.2 90.63,35.15 91.64,35.15 92.66,34.14 92.66,30.48 89.61,27.43 SJ3.3 87.94,14.63 v85.95,14.63 | 89.61,54.46 89.81,54.66 SJ4.3 | 82.7,38.62 82.7,39.89 C33.+
  Top 0.62: PWRHEAD2.4 7.32,9.96 5.69,11.58 5.69,13.41 7.32,15.04 v10.16,15.04
  Top 1.016: IC2.2 84.12,35.36 82.7,36.78 82.7,38.62 | C33.+ 87.26,44.46 C29.1 88.58,54.46 89.61,54.46
  Top 1.778: PWRHEAD2.16 PWRHEAD2.15 PWRHEAD2.14 PWRHEAD2.13 PWRHEAD2.12 PWRHEAD2.11 PWRHEAD2.10 PWRHEAD2.9 PWRHEAD2.8 PWRHEAD2.7 PWRHEAD2.6 PWRHEAD2.5 PWRHEAD2.4 PWRHEAD2.3 PWRHEAD2.2 PWRHEAD2.1
  Bottom 0.61: v15.65,18.09 11.18,22.55 v11.18,27.23 | v85.95,14.63 49.78,14.63 48.36,13.21 48.36,11.18 47.14,9.96 PWRHEAD2.16
  Bottom 0.62: v15.65,18.09 15.65,15.65 15.04,15.04 v10.16,15.04
BOOT0  (via drill 0.38)
  Top 0.203: U1.94 50.03,32.36 50.01,32.38 v49.99,32.38 | v38.81,26.21 v41.45,26.21 | R17.2 28.03,23.98 32.72,23.98 v33.53,23.16 | v33.93,21.54 34.54,20.93 34.54,19.3 32.51,17.27 32.51,14.63 v31.7,13.82
  Top 0.254: v33.93,21.54 33.93,22.76 v33.53,23.16
  Bottom 0.203: v41.45,26.21 41.25,26.42 41.25,27.43 41.66,27.84 45.44,27.84 v49.99,32.38 | PINHEAD1.14 14.28,11.18 28.85,11.18 29.46,11.79 29.46,13.41 29.87,13.82 v31.7,13.82 | v33.93,21.54 38.61,26.21 v38.81,26.21
BOOT1  (via drill 0.38)
  Top 0.203: v41.05,29.26 40.23,29.26 v39.42,28.45 | U1.37 65.32,34.86 64.41,35.76 56.49,35.76 v56.08,35.36 | v19.91,14.43 20.12,14.22 26.21,14.22 26.82,14.83 v27.64,14.83 | 27.64,22.11 27.64,22.19 R18.2
  Top 0.254: v27.64,20.12 27.64,22.11
  Bottom 0.203: v56.08,35.36 55.68,34.95 53.34,34.95 53.14,34.75 46.74,34.75 41.25,29.26 v41.05,29.26 | v27.64,14.83 v27.64,20.12 35.15,27.64 38.61,27.64 v39.42,28.45 | v19.91,14.43 12.34,14.43 PINHEAD1.15
COM1_RX  (via drill 0.38)
  Top 0.203: v25.81,20.52 26.42,19.91 v26.42,18.09 | U1.69 56.94,44.66 v56.69,44.91
  Bottom 0.203: v26.42,18.09 26.42,13.26 PINHEAD1.9 | v25.81,20.52 26.21,20.93 27.84,20.93 34.95,28.04 37.39,28.04 38.71,29.36 38.71,29.97 44.5,35.76 44.5,36.58 48.36,40.44 48.36,42.27 51.82,45.72 55.88,45.72 v56.69,44.91
COM1_TX  (via drill 0.38)
  Top 0.203: v62.18,40.84 62.59,40.84 63.94,42.2 U1.55 | v34.34,15.04 v36.58,15.04 | v43.48,20.32 43.48,22.05 45.97,24.54 50.39,24.54 52.83,26.98 v52.83,27.84
  Bottom 0.203: v62.18,40.84 61.57,40.23 61.57,33.32 59.64,31.39 59.64,29.97 57.51,27.84 v52.83,27.84 | v43.48,20.32 38.2,15.04 v36.58,15.04 | PINHEAD1.8 28.19,13.31 30.33,15.44 33.53,15.44 33.93,15.04 v34.34,15.04
COM2_RX  (via drill 0.38)
  Top 0.203: v23.37,17.88 22.76,17.88 v20.93,16.05 | U1.87 50.3,35.86 47.75,38.4 44.5,38.4 v43.89,39.01
  Bottom 0.203: v23.37,17.88 23.16,18.09 23.16,20.32 25.2,22.35 27.03,22.35 34.54,29.87 34.54,30.48 35.36,31.29 35.36,32.71 36.78,34.14 40.44,34.14 42.47,36.17 42.47,38.2 43.28,39.01 v43.89,39.01 | PINHEAD1.11 20.93,12.85 v20.93,16.05
COM2_TX  (via drill 0.38)
  Top 0.203: U1.86 50.41,36.36 47.55,39.22 v44.91,39.22
  Bottom 0.203: PINHEAD1.10 23.22,12.6 23.37,12.6 23.37,16.87 22.55,17.68 22.55,20.32 24.99,22.76 26.82,22.76 34.14,30.07 34.14,30.68 34.95,31.5 34.95,32.92 36.58,34.54 40.23,34.54 42.06,36.37 42.06,38.81 43.08,39.83 44.5,39.83 44.91,39.42 v44.91,39.22
COM3_RX  (via drill 0.38)
  Top 0.203: U1.56 63.44,42.31 62.99,41.86 58.93,41.86 v58.73,41.66 | v34.14,16.05 v35.76,16.05 | v27.23,13.82 20.32,13.82 20.12,13.61 v19.3,13.61
  Bottom 0.203: v35.76,16.05 38.61,16.05 41.05,18.49 41.05,19.71 40.64,20.12 40.64,27.64 41.86,28.85 41.86,29.26 46.94,34.34 52.02,34.34 53.03,33.32 54.25,33.32 54.46,33.53 55.47,33.53 55.88,33.12 57.3,33.12 58.73,34.54 v58.73,41.66 | v34.14,16.05 30.07,16.05 28.04,14.02 27.23,14.02 v27.23,13.82 | PINHEAD1.13 16.82,13.82 19.1,13.82 v19.3,13.61
COM3_TX  (via drill 0.38)
  Top 0.203: U1.68 57.44,45.17 v56.49,46.13 | PINHEAD1.12 18.03,13.16 | PINHEAD1.12 18.03,13.36 | PINHEAD1.12 18.03,13.77 19.51,15.24 20.93,15.24 21.34,14.83 22.76,14.83 22.96,15.04 v25.4,15.04
  Bottom 0.203: v25.4,15.04 25.4,17.27 24.59,18.09 24.59,20.52 25.6,21.54 27.84,21.54 35.15,28.85 35.76,28.85 36.58,29.67 36.58,32.11 37.39,32.92 41.05,32.92 44.09,35.97 44.09,36.78 47.95,40.64 47.95,42.47 51.61,46.13 v56.49,46.13
D0  (via drill 0.38)
  Top 0.203: U1.78 52.95,40.36 53.24,40.64 53.24,49.78 v50.39,52.63
  Bottom 0.203: v50.39,52.63 43.54,59.49 PINHEAD3.16
D1  (via drill 0.38)
  Top 0.203: U1.98 53.12,30.36 53.44,30.68 53.44,33.53 v54.05,34.14
  Top 0.254: v56.08,34.14 54.86,35.36 v54.86,35.76
  Bottom 0.203: v54.86,35.76 54.86,42.06 55.88,43.08 57.91,43.08 59.13,44.3 59.13,56.49 58.32,57.3 53.24,57.3 PINHEAD4.1 | v54.05,34.14 v56.08,34.14
D2  (via drill 0.38)
  Top 0.203: U1.1 53.94,32 v54.66,32.71
  Bottom 0.203: v54.66,32.71 57.51,32.71 59.54,34.75 59.54,56.9 58.73,57.71 55.37,57.71 PINHEAD4.2
D3  (via drill 0.38)
  Top 0.203: U1.2 54.44,31.48 v54.66,31.7
  Bottom 0.203: v54.66,31.7 55.27,32.31 57.71,32.31 59.94,34.54 59.94,57.3 59.13,58.11 57.51,58.11 PINHEAD4.3
D4  (via drill 0.38)
  Top 0.203: U1.3 54.94,30.76 v55.68,31.5
  Bottom 0.203: PINHEAD4.4 60.35,57.81 60.35,34.34 57.91,31.9 56.08,31.9 v55.68,31.5
D5  (via drill 0.38)
  Top 0.203: U1.4 55.44,29.84 v56.69,31.09
  Bottom 0.203: v56.69,31.09 57.71,31.09 60.76,34.14 60.76,59.03 PINHEAD4.5
  Bottom 0.254: PINHEAD4.5 61.16,59.44
D6  (via drill 0.38)
  Top 0.203: v58.93,31.29 58.73,31.09 57.91,31.09 55.94,29.12 U1.5
  Bottom 0.203: PINHEAD4.6 63.75,59.28 61.16,56.69 61.16,33.53 v58.93,31.29
D7
  Top 0.203: U1.51 65.94,59.14 PINHEAD4.7
D8
  Top 0.203: U1.46 69.02,39.36 69.29,39.62 69.29,59.03 PINHEAD4.8
D9
  Top 0.203: U1.45 69.13,38.86 69.7,39.42 69.7,57.81 PINHEAD4.9
D10
  Top 0.203: U1.44 69.24,38.36 70.1,39.22 70.1,55.68 PINHEAD4.10
D11
  Top 0.203: U1.43 69.35,37.86 70.51,39.01 70.51,53.54 PINHEAD4.11
D12
  Top 0.203: U1.42 69.46,37.36 70.92,38.81 70.92,51.41 PINHEAD4.12
D13
  Top 0.203: U1.41 69.57,36.86 71.32,38.61 71.32,49.28 PINHEAD4.13
D14
  Top 0.203: U1.40 69.68,36.36 71.73,38.4 71.73,47.14 PINHEAD4.14
D15
  Top 0.203: U1.39 69.79,35.86 72.14,38.2 72.14,45.01 PINHEAD4.15
D16
  Top 0.203: U1.38 69.9,35.36 72.54,38 72.54,42.88 PINHEAD4.16
DAC1  (via drill 0.38)
  Top 0.203: U1.29 68.91,30.86 70.31,29.46 70.31,21.95 v68.89,20.52 | v49.38,20.52 49.38,20.12 45.72,16.46 v43.28,16.46 | PINHEAD1.16 9.4,14.02 15.85,14.02 16.76,13.11 16.76,11.89 17.48,11.18 28.85,11.18 29.46,11.79 29.46,13.41 v30.68,14.63 | v34.95,14.22 v37.39,14.22
  Bottom 0.203: v30.68,14.63 32.72,14.63 33.12,14.22 v34.95,14.22 | 37.59,14.43 41.25,14.43 v43.28,16.46 | v49.38,20.52 v68.89,20.52
  Bottom 0.254: v37.39,14.22 37.59,14.43
DAC2  (via drill 0.38)
  Top 0.203: U1.30 69.43,31.36 v69.9,30.89
  Bottom 0.203: v69.9,30.89 72.75,28.04 73.97,28.04 89.15,12.85 PINHEAD2.1
GND  (via drill 0.38)
  other vias: 16.26,34.14 65.02,21.54 19.51,26.01 25.6,24.79 35.36,25.4 28.45,18.69 54.25,44.91 49.38,50.8 36.17,19.71 27.03,41.66 27.84,44.3 26.42,35.36 52.02,42.88 7.11,56.69 9.96,53.04 8.94,53.04 10.97,53.04 29.06,36.58 18.08,49.17 14.43,48.77 19.51,54.86 12.4,55.27 5.69,57.71 5.69,56.69 5.69,55.68 5.69,54.66 5.69,53.64 5.69,52.63 5.69,51.61 5.69,50.6 5.69,49.58 5.69,48.56 6.1,46.74 5.08,46.74 4.06,46.74 3.05,46.74 2.03,46.74 13.41,54.05
  pour Bottom: 0,73.66 95.25,73.66 95.25,-1.27 0,-1.27 0,46.99 5.33,46.99 5.33,59.69 0,59.69
  pour Top: 0,73.66 95.25,73.66 95.25,-1.27 0,-1.27 0,46.99 5.33,46.99 5.33,59.69 0,59.69
JTCK  (via drill 0.38)
  Top 0.203: v49.78,42.47 50.83,42.47 U1.76 | 39.62,22.15 37.39,24.38 37.39,27.64 v39.42,29.67
  Top 0.254: 39.62,22.15 U5.P$5 39.62,20.12 39.01,19.51 36.98,19.51 35.76,18.29 v35.76,17.88
  Bottom 0.203: v49.78,42.47 48.77,41.45 48.77,40.23 44.91,36.37 44.91,35.56 39.42,30.07 v39.42,29.67 | v35.76,17.88 35.36,17.48 35.36,16.66 34.95,16.26 34.95,15.44 37.9,12.5 PINHEAD1.4
JTDI  (via drill 0.38)
  Top 0.203: U5.P$6 39.62,16.31 PINHEAD1.2 | U1.77 51.93,40.84 50.8,40.84 v50.39,41.25
  Top 0.254: U5.P$6 39.62,18.69 v40.23,19.3
  Bottom 0.203: v50.39,41.25 45.31,36.17 45.31,35.36 40.23,30.28 v40.23,19.3
JTDO  (via drill 0.38)
  Top 0.203: 38.35,15.85 U5.P$8 | v24.18,17.07 v30.07,17.07 | v34.54,17.07 35.76,17.07 36.98,15.85 38.35,15.85 | PINHEAD1.5 36.73,13.41 37.54,13.41 38.35,14.22 38.35,15.85 | U1.89 50.08,34.86 47.55,37.39 43.48,37.39 v43.28,37.59
  Bottom 0.203: v24.18,17.07 24.18,20.73 25.4,21.95 27.23,21.95 34.95,29.67 34.95,30.28 35.76,31.09 35.76,32.51 36.98,33.73 40.64,33.73 43.28,36.37 v43.28,37.59 | v30.07,17.07 v34.54,17.07
JTMS  (via drill 0.38)
  Top 0.203: v44.3,17.88 42.67,19.51 41.25,19.51 40.89,19.86 U5.P$3 40.89,22.2 41.45,22.76 42.47,22.76 42.88,23.16 v42.88,28.85 | v47.35,33.63 v47.35,35.86 | 55.47,43.39 55.47,44.7 v55.68,44.91
  Top 0.254: 55.47,43.39 U1.72
  Bottom 0.203: v44.3,17.88 44.3,15.9 PINHEAD1.3 | v55.68,44.91 55.47,44.91 54.46,43.89 54.46,41.76 48.56,35.86 v47.35,35.86 | v47.35,33.63 47.35,33.32 v42.88,28.85
JTRST
  Top 0.203: 40.89,16.82 43.48,14.22 44.25,14.22 PINHEAD1.1
  Top 0.254: 40.89,16.82 U5.P$4
LED0  (via drill 0.38)
  Top 0.203: 67.91,33.32 65.84,33.32 v62.38,29.87 | v39.42,27.03 v42.06,27.03
  Top 0.254: R8.1 30.11,20.69 v30.89,19.91 | 67.91,33.32 U1.34
  Bottom 0.203: v62.38,29.87 59.54,27.03 v42.06,27.03 | v30.89,19.91 33.33,22.35 33.93,22.35 38.61,27.03 v39.42,27.03
LED1  (via drill 0.38)
  Top 0.203: U1.33 69.03,32.86 v69.29,33.12 | 72.34,28.25 72.34,20.73 72.95,20.12 v72.95,19.71 | R9.1 32.16,19.11 31.74,18.69 | v39.42,23.37 41.86,23.37 v42.06,23.57
  Top 0.254: 72.34,28.25 v73.15,29.06 | v31.09,18.69 31.74,18.69
  Bottom 0.203: v73.15,29.06 69.29,32.92 | v72.95,19.71 48.77,19.71 44.91,23.57 v42.06,23.57 | v39.42,23.37 38.81,23.37 34.14,18.69 v31.09,18.69
  Bottom 0.254: 69.29,32.92 v69.29,33.12
MCO  (via drill 0.38)
  Top 0.203: U1.67 57.94,45.69 55.47,48.16 v54.05,48.16 | PINHEAD1.7 31.39,12.5 32.92,14.02 32.92,17.07 34.95,19.1 34.95,22.55 36.58,24.18 36.58,28.04 35.76,28.85 v35.76,29.87
  Bottom 0.203: v35.76,29.87 36.17,30.28 36.17,32.31 37.19,33.32 40.84,33.32 43.69,36.17 43.69,36.98 47.55,40.84 47.55,42.67 53.03,48.16 v54.05,48.16
N$1
  Top 0.203: U1.12 59.44,25.06 C17.1 59.32,24.17 55.47,20.32 53.24,20.32 52.63,19.71 52.63,18.13 Q1.1
N$2  (via drill 0.38)
  Top 0.203: C16.1 C9.1 | U1.22 U1.21 v63.94,25.81 63.94,24.59 C16.1 | L1.2 48.41,28.4 | C8.1 63.2,21.28 63.2,23.98 63.75,24.54 63.92,24.54 C16.1 | L1.2 48.38,27.01 | v48.36,25.81 48.36,28.38 L1.2
  Bottom 0.203: v63.94,25.81 63.54,25.4 48.77,25.4 v48.36,25.81
N$3
  Top 0.203: U1.13 59.94,26.42 60.35,26.01 60.35,23.07 59.93,22.66 C18.1 59.93,21.13 Q1.3
N$4
  Top 0.254: U$23.1 13.9,18.65 U$24.3 15.69,20.24 R36.1 17.99,16.89 R35.2
N$6
  Top 0.254: C11.1 67.56,42.77 66.65,41.86 66.65,41.05 66.85,40.84 67.93,40.84 U1.49
N$7
  Top 0.203: 54.66,45.73 C10.1 54.94,45.95 U1.73
N$8
  Top 0.203: C20.1 50.66,23.93 Q2.P$2 53.09,25.2 56.29,25.2 57.44,26.35 U1.8
N$9
  Top 0.203: 57.91,27.32 57.91,26.21 55.63,23.93 Q2.P$1 55.12,22.82 C19.1
  Top 0.254: 57.91,27.32 U1.9
N$10
  Top 0.254: R8.2 28.81,22.53 LED1.C
N$11
  Top 0.203: U6.P$9 18.78,30.97 19.66,31.85 R1.1
  Top 0.254: U6.P$9 18.09,30.99
N$12
  Top 0.203: LED2.C 32,20.97 R9.2
N$13  (via drill 0.38)
  Top 0.203: U3.1 33.91,34.92 v32.11,33.12
  Top 0.254: v27.64,33.73 27.22,33.73 R10.1
  Bottom 0.203: v32.11,33.12 28.25,33.12 v27.64,33.73
N$14
  Top 0.203: U3.2 32.65,34.68 27.03,29.06 26.36,29.06
  Top 0.254: R11.1 26.36,29.06
N$15
  Top 0.203: 31.37,27.09 U3.6
  Top 0.254: R12.2 31.37,27.09
N$16
  Top 0.203: R13.2 28.17,27.74 U3.5
N$17
  Top 0.203: L2.1 8.53,48.8 C12.2
N$18
  Top 0.203: 13.61,47.04 12.87,47.04 12.8,47.1 L3.2 | 13.61,47.04 L4.2 14.14,47.43 13.61,47.95 13.61,50.8 13.01,51.41 13.01,52.22 13.63,52.85 U2.12 | 13.61,47.04 13.82,47.24
N$19
  Top 0.203: ANT.FEED 3.75,47.71 C13.1 7.32,47.3 C12.1
N$20  (via drill 0.38)
  Top 0.203: L2.2 10.7,47.1 L3.1 v12.39,50.6 | U2.13 14.3,52.35 13.97,52.02 v13.82,52.02
  Bottom 0.203: v12.39,50.6 12.39,51.21 13.21,52.02 v13.82,52.02
N$21  (via drill 0.38)
  Top 0.203: L4.1 16.26,46.62 | L4.1 15.84,47.53 16.05,47.75 18.29,47.75 v19.1,48.56 | U2.11 15.03,54.27 v14.43,54.86 | C21.1 18.86,45.11 15.08,45.11 C14.1 15.84,46.28 L4.1
  Bottom 0.203: v19.1,48.56 19.1,50.19 v14.43,54.86
N$23  (via drill 0.38)
  Top 0.203: R16.2 17.23,47.14 18.49,47.14 v18.69,46.94 | U2.16 15.09,50.45 v14.83,50.19
  Bottom 0.203: v18.69,46.94 18.09,46.94 v14.83,50.19
N$24
  Top 0.203: C24.1 15.66,48.98 16.05,49.38 16.87,49.38 17.43,49.94 U2.19
N$25
  Top 0.254: U$23.2 12,20.37 R34.1
N$26  (via drill 0.38)
  Top 0.203: C22.1 7.32,50.19 7.72,49.78 10.36,49.78 11.06,50.48 Q3.1 12.19,52.27 v12.19,53.03 | U2.9 16.43,55.03 v16.87,55.47
  Bottom 0.203: v16.87,55.47 16.46,55.88 14.02,55.88 12.19,54.05 v12.19,53.03
N$27
  Top 0.203: U2.10 15.93,54.99 14.83,56.08 9.6,56.08 8.76,55.25 | C23.1 8.49,55.51 8.76,55.25 | 8.76,55.25 Q3.3
N$28  (via drill 0.38)
  Top 0.203: U3.3 31.38,34.43 27.03,30.07 24.59,30.07 v23.77,29.26 | 21.09,27.64 20.32,27.64 v19.91,28.04
  Top 0.254: 21.09,27.64 R15.2
  Bottom 0.203: v23.77,29.26 22.55,28.04 v19.91,28.04
N$29  (via drill 0.38)
  Top 0.203: v31.29,32.11 32.64,30.76 U3.7
  Top 0.254: R14.1 27.28,31.55 v27.84,32.11 | U3.7 32.51,29.79
  Bottom 0.203: v27.84,32.11 v31.29,32.11
N$30
  Top 0.203: R17.1 25.55,23.52 24.99,22.96 23.77,22.96 23.57,23.16 23.57,23.67 23.62,23.72 SJ1.2
N$31
  Top 0.203: 26.17,22.35 23.57,22.35 23.16,21.95 23.16,21.13 SJ2.2
  Top 0.254: 26.17,22.35 R18.1
N$38
  Top 0.203: 12.28,26.91 10.77,25.4 10.77,24.18 10.05,23.46 X2.2
  Top 0.254: 12.28,26.91 U4.1
PH1LINE
  Top 0.61: SJ4.2 90.63,58.11 91.44,58.93 91.44,60.76 90.22,61.98 89.2,61.98 PWRHEAD1.16
  Top 1.778: PWRHEAD1.16 PWRHEAD1.15 PWRHEAD1.14 PWRHEAD1.13 PWRHEAD1.12 PWRHEAD1.11 PWRHEAD1.10 PWRHEAD1.9 PWRHEAD1.8 PWRHEAD1.7 PWRHEAD1.6 PWRHEAD1.5 PWRHEAD1.4 PWRHEAD1.3 PWRHEAD1.2 PWRHEAD1.1
PH3LINE
  Top 0.61: SJ3.2 90.42,13.82 90.83,13.41 90.83,11.63 PWRHEAD3.1
  Top 1.778: PWRHEAD3.1 PWRHEAD3.2 PWRHEAD3.3 PWRHEAD3.4 PWRHEAD3.5 PWRHEAD3.6 PWRHEAD3.7 PWRHEAD3.8 PWRHEAD3.9 PWRHEAD3.10 PWRHEAD3.11 PWRHEAD3.12 PWRHEAD3.13 PWRHEAD3.14 PWRHEAD3.15 PWRHEAD3.16
PH4LINE
  Top 1.778: BATTHEAD2.2 PWRHEAD4.1 PWRHEAD4.2 PWRHEAD4.3 PWRHEAD4.4 PWRHEAD4.5 PWRHEAD4.6 PWRHEAD4.7 PWRHEAD4.8 PWRHEAD4.9 PWRHEAD4.10 PWRHEAD4.11 PWRHEAD4.12 PWRHEAD4.13 PWRHEAD4.14 PWRHEAD4.15 PWRHEAD4.16
  pour Bottom (no thermals): 45.52,62.79 42.47,62.79 42.47,61.16 45.52,61.16
RF24_CE  (via drill 0.38)
  Top 0.203: U1.81 50.96,38.86 47.75,42.06 39.42,42.06 38.61,42.88 36.98,42.88 30.07,49.78 v30.07,51.61 | v21.74,49.99 20.73,49.99 19.36,51.35 U2.1
  Bottom 0.203: v21.74,49.99 28.65,49.99 30.07,51.41 v30.07,51.61
RF24_CS  (via drill 0.38)
  Top 0.203: U1.82 50.85,38.36 47.55,41.66 39.22,41.66 38.41,42.47 36.78,42.47 29.06,50.19 v29.06,51.61 | U2.2 19.88,51.85 v20.93,50.8
  Bottom 0.203: v29.06,51.61 29.06,51.41 28.45,50.8 v20.93,50.8
RF24_IRQ  (via drill 0.38)
  Top 0.203: U1.84 50.63,37.36 47.14,40.84 37.8,40.84 28.04,50.6 v28.04,51.61 | v18.49,55.27 17.93,54.7 U2.6
  Bottom 0.203: v28.04,51.61 27.23,52.43 19.51,52.43 18.49,53.44 v18.49,55.27
SA  (via drill 0.38)
  Top 0.203: 38.35,22.81 37.59,23.57 36.98,23.57 | 36.98,23.57 36.58,23.57 35.36,22.35 35.36,18.9 33.27,16.82 PINHEAD1.6 | 36.58,37.19 36.98,36.78 36.98,34.54 37.59,33.93 v37.59,32.11 | 36.58,37.19 30.79,42.98 | 30.79,42.98 30.73,43.03 R48.1 C45.1 | 36.98,23.57 v36.98,28.85 | 36.58,37.19 v35.97,36.58 | U1.14 60.44,29.96 61.16,30.68 61.16,31.7 60.35,32.51 56.29,32.51 55.27,33.53 55.27,34.14 54.46,34.95 53.65,34.95 53.05,34.36 U1.90 51.93,34.34 49.99,34.34 47.75,36.58 v40.84,36.58 | v29.67,42.06 29.87,42.06 30.79,42.98 | RSTSWITCH.3 35.23,47.62 v34.75,47.14
  Top 0.254: 38.35,22.81 U5.P$7
  Bottom 0.203: v37.59,32.11 36.98,31.5 v36.98,28.85 | v35.97,36.58 v40.84,36.58 | v29.67,42.06 v34.75,47.14
SDIO_CLK
  Top 0.203: U6.P$5 18.82,35.27 20.17,36.63 R4.1
SDIO_CMD  (via drill 0.38)
  Top 0.203: R5.1 23.76,40.22 v23.98,40.44 | U6.P$3 18.98,37.47 20.32,38.81 v20.93,38.81 | U1.83 50.74,37.86 47.35,41.25 38.61,41.25 v38.2,41.66 | v28.85,37.59 30.07,38.81 v30.07,40.44
  Bottom 0.203: 23.98,41.25 24.59,41.25 28.25,37.59 v28.85,37.59 | 23.98,41.25 v23.98,40.44 | 23.98,41.25 23.16,41.25 20.93,39.01 v20.93,38.81 | v38.2,41.66 31.9,41.66 30.68,40.44 v30.07,40.44
SDIO_D0  (via drill 0.38)
  Top 0.203: U1.66 58.44,45.8 55.27,48.97 v54.66,48.97 54.86,48.97 | v28.45,39.42 26.21,39.42 v25.6,38.81 | U6.P$7 18.65,33.07 19.1,33.53 19.1,34.34 v20.12,35.36 R3.1
  Bottom 0.203: v54.66,48.97 53.24,48.97 44.5,40.23 41.05,40.23 39.62,38.81 29.06,38.81 v28.45,39.42 | v25.6,38.81 23.57,38.81 v20.12,35.36
SDIO_D1  (via drill 0.38)
  Top 0.203: U1.65 58.94,45.91 55.07,49.78 v54.05,49.78 | v28.45,40.64 25.81,40.64 24.79,39.62 24.79,38.61 25.4,38 27.03,38 28.04,36.98 28.04,35.76 26.82,34.54 24.18,34.54 v23.57,35.15 | U6.P$8 18.36,31.97 v19.91,33.53 20.47,34.09 R2.1
  Top 0.254: R2.1 21.11,34.01
  Bottom 0.203: v54.05,49.78 53.44,49.78 44.3,40.64 40.84,40.64 39.42,39.22 29.87,39.22 v28.45,40.64 | v23.57,35.15 21.95,33.53 v19.91,33.53
SDIO_D2  (via drill 0.38)
  Top 0.203: U1.79 50.57,39.86 47.95,42.47 39.62,42.47 38.81,43.28 37.8,43.28 v37.39,43.69 | v30.89,41.66 30.89,37.79 v30.68,37.59 | U6.P$1 20.43,39.67 | 20.43,39.67 R7.1 | 20.43,39.67 20.38,39.62 v20.12,39.62
  Bottom 0.203: v41.45,39.42 40.84,39.42 39.83,38.4 30.68,38.4 | 30.68,38.4 28.04,38.4 24.79,41.66 22.96,41.66 20.98,39.67 20.12,39.67 v20.12,39.62 | v37.39,43.69 37.39,43.48 35.97,42.06 31.29,42.06 v30.89,41.66 | 30.68,38.4 v30.68,37.59
SDIO_D3  (via drill 0.38)
  Top 0.203: U1.97 34.78,30.86 33.93,31.7 v33.12,31.7 | R6.1 20.99,29.01 20.84,28.85 19.71,28.85 19.3,28.45 17.27,28.45 v16.87,28.04 | U6.P$2 16.43,38.57 15.04,37.19 15.04,29.87 v16.87,28.04 | v16.87,28.04 17.07,28.25
  Bottom 0.203: v33.12,31.7 31.29,29.87 26.42,29.87 23.37,26.82 18.09,26.82 v16.87,28.04
SDIO_DETECT  (via drill 0.38)
  Top 0.203: U1.52 65.44,41.67 64.62,40.84 v63.6,40.84 | v63.6,38.61 61.57,36.58 54.46,36.58 v53.65,35.76 | v18.09,29.87 18.89,29.87 R1.2 | v46.33,35.56 46.23,35.66 v40.03,35.66
  Bottom 0.203: v63.6,38.61 v63.6,40.84 | v18.09,29.87 19.91,29.87 24.59,34.54 27.03,34.54 28.14,35.66 v40.03,35.66 | v53.65,35.76 53.03,35.15 46.74,35.15 v46.33,35.56
SPI_MISO  (via drill 0.38)
  Top 0.203: v24.59,53.44 24.59,52.83 39.01,38.4 43.48,38.4 43.99,37.9 47.65,37.9 50.19,35.36 U1.88 | U2.5 19.6,53.35 19.69,53.44 19.71,53.44 v19.91,53.64
  Bottom 0.203: v19.91,53.64 24.38,53.64 v24.59,53.44
SPI_MOSI  (via drill 0.38)
  Top 0.203: U1.57 62.94,46.17 53.03,56.08 35.36,56.08 v34.75,56.69 | v20.52,54.46 20.73,54.25 20.73,53.44 20.13,52.85 U2.4
  Bottom 0.203: v34.75,56.69 22.76,56.69 v20.52,54.46
SPI_SCK  (via drill 0.38)
  Top 0.203: U1.85 50.52,36.86 46.94,40.44 37.59,40.44 27.03,51 v27.03,51.61 | v21.54,51.61 20.8,52.35 U2.3
  Bottom 0.203: v21.54,51.61 v27.03,51.61
T0
  Top 0.203: PINHEAD3.1 8.33,56.49 18.29,56.49 19.1,55.68 20.73,55.68 21.34,55.07 21.34,53.03 37.39,36.98 37.39,34.75 40.84,31.29 50.8,31.29 50.86,31.36 U1.96
T1
  Top 0.203: PINHEAD3.2 10.46,56.9 18.49,56.9 19.3,56.08 20.93,56.08 21.74,55.27 21.74,53.24 37.8,37.19 37.8,34.95 41.05,31.7 50.6,31.7 50.75,31.86 U1.95
T2
  Top 0.203: PINHEAD3.3 12.6,57.3 18.69,57.3 19.51,56.49 21.13,56.49 22.15,55.47 22.15,53.44 38.2,37.39 38.2,35.15 41.25,32.11 48.56,32.11 49.58,33.12 50.6,33.12 50.86,32.86 U1.93
T3
  Top 0.203: PINHEAD3.4 14.73,57.71 18.9,57.71 19.71,56.9 21.34,56.9 22.55,55.68 22.55,53.64 38.61,37.59 38.61,35.36 41.45,32.51 48.36,32.51 49.38,33.53 50.8,33.53 50.97,33.36 U1.92 51.91,33.32
T4
  Top 0.203: PINHEAD3.5 16.87,58.11 19.1,58.11 19.91,57.3 21.54,57.3 22.96,55.88 22.96,53.85 39.01,37.79 39.01,35.56 41.66,32.92 48.16,32.92 49.17,33.93 51,33.93 51.08,33.86 U1.91
T5
  Top 0.203: U1.64 59.44,46.02 51.82,53.64 25.81,53.64 21.74,57.71 20.12,57.71 19.3,58.52 18.9,58.52 18.03,59.38 PINHEAD3.6
T6
  Top 0.203: U1.63 59.94,46.13 52.02,54.05 26.01,54.05 PINHEAD3.7
T7
  Top 0.203: U1.62 60.44,46.24 52.22,54.46 28.14,54.46 PINHEAD3.8
T8
  Top 0.203: U1.61 60.94,46.35 52.43,54.86 30.28,54.86 PINHEAD3.9
T9
  Top 0.203: U1.60 61.44,46.45 52.63,55.27 32.41,55.27 PINHEAD3.10
T10
  Top 0.203: U1.59 61.94,46.56 52.83,55.68 34.54,55.68 PINHEAD3.11
T11
  Top 0.203: PINHEAD3.12 36.27,56.49 53.24,56.49 64.44,45.28 U1.54
T12
  Top 0.203: PINHEAD3.13 38.41,56.9 53.44,56.9 64.94,45.39 U1.53
T13  (via drill 0.38)
  Top 0.203: PINHEAD3.14 40.54,57.3 53.65,57.3 62.18,48.77 v62.59,48.77 | U1.47 67.09,39.86 66.45,39.22 66.45,38.81 v65.63,38
  Bottom 0.203: v65.63,38 64.41,39.22 64.41,46.94 v62.59,48.77
T14  (via drill 0.38)
  Top 0.203: PINHEAD3.15 42.67,57.71 53.85,57.71 61.57,49.99 v62.59,49.99
  Top 0.254: U1.48 66.77,40.36 v65.63,39.22
  Bottom 0.203: v65.63,39.22 65.43,39.22 64.82,39.83 64.82,47.75 v62.59,49.99
TA0
  Top 0.203: U1.36 69.68,34.36 71.93,32.11 71.93,17.27 74.37,14.83 76.66,14.83 PINHEAD2.5
TA1
  Top 0.203: U1.35 69.57,33.86 71.53,31.9 71.53,16.26 73.76,14.02 74.93,14.02 PINHEAD2.6
TA2
  Top 0.203: U1.32 70.26,32.36 71.12,31.5 71.12,15.24 73.86,12.5 PINHEAD2.7
TA3
  Top 0.203: U1.31 70.15,31.86 70.71,31.29 70.71,13.16 PINHEAD2.8
TA4
  Top 0.203: U1.26 67.46,28.88 67.46,18.69 68.83,17.32 PINHEAD2.9
TA5
  Top 0.203: PINHEAD2.10 66.29,17.93 67.06,18.69 67.06,25.4 65.94,26.51 U1.25
TA6
  Top 0.203: U1.24 65.44,26.4 66.65,25.2 66.65,19.1 63.75,16.21 PINHEAD2.11
TA7
  Top 0.203: PINHEAD2.12 61.21,14.28 66.24,19.3 66.24,24.99 64.94,26.29 U1.23
TA8
  Top 0.203: U1.18 62.44,16.27 PINHEAD2.13
TA9
  Top 0.203: U1.17 61.94,16.43 59.74,14.22 57.86,14.22 PINHEAD2.14
TA10
  Top 0.203: U1.16 61.44,16.54 59.54,14.63 55.73,14.63 PINHEAD2.15
TA11
  Top 0.203: U1.15 60.94,16.65 59.33,15.04 53.59,15.04 PINHEAD2.16
USB_DISC  (via drill 0.38)
  Top 0.203: PINHEAD2.4 81.53,14.17 v79.25,16.46 | v60.35,31.09 59.54,30.28 v58.73,30.28 | v57.3,28.85 56.99,28.85 56.94,28.81 U1.7 56.94,26.46 56.69,26.21 v53.24,26.21 | v33.33,32.92 34.34,32.92 35.97,31.29 38.2,31.29 v38.61,31.7 | v18.49,27.64 19.3,26.82 20.84,26.82 R37.1 | v46.53,26.21 46.53,29.67 45.72,30.48 38.61,30.48 v37.8,29.67
  Top 0.61: R37.1 17.16,22.44 U$24.1
  Bottom 0.203: v79.25,16.46 66.45,29.26 64.01,29.26 62.18,31.09 v60.35,31.09 | v57.3,28.85 57.91,28.85 58.73,29.67 v58.73,30.28 | v53.24,26.21 52.83,26.62 46.94,26.62 v46.53,26.21 | v33.33,32.92 30.89,30.48 26.21,30.48 22.96,27.23 18.9,27.23 v18.49,27.64 | v38.61,31.7 37.8,30.89 v37.8,29.67
USB_DM  (via drill 0.38)
  Top 0.203: v57.3,41.45 56.44,42.31 U1.70 | v62.79,33.73 58.73,33.73 v57.71,34.75 | v68.68,25.81 68.68,27.64 v69.49,28.45 | v22.55,16.46 22.76,16.26 30.28,16.26 32.92,18.9 32.92,20.12 v33.33,20.52 | v39.42,25.4 v42.06,25.4 | PINHEAD2.2 81.64,17.48 v80.47,17.48
  Top 0.254: U4.6 17.19,26.91 v18.49,25.6
  Bottom 0.203: v39.42,25.4 39.01,25.4 34.14,20.52 v33.33,20.52 | v68.68,25.81 67.87,24.99 42.47,24.99 v42.06,25.4 | v69.49,28.45 v80.47,17.48 | v69.49,28.45 69.29,28.65 | v22.55,16.46 21.95,17.07 21.95,20.93 18.49,24.38 v18.49,25.6 | v69.49,28.45 64.21,33.73 v62.79,33.73 | v57.71,34.75 57.71,41.05 v57.3,41.45
USB_DP  (via drill 0.38)
  Top 0.203: v62.18,32.92 58.12,32.92 v57.1,33.93 | v55.88,41.45 55.94,41.52 U1.71 | U4.4 17.26,25.01 v17.48,24.79 | v39.01,24.38 v41.45,24.38 | v80.26,16.46 84.07,12.65 PINHEAD2.3 | v21.95,15.65 22.76,15.65 22.96,15.85 30.48,15.85 33.73,19.1 v33.73,19.51
  Top 0.254: R34.2 14.71,25.01 U4.4 | v69.49,24.99 v69.49,27.23
  Bottom 0.203: v17.48,24.79 21.54,20.73 21.54,16.46 21.95,16.05 v21.95,15.65 | v41.45,24.38 68.89,24.38 v69.49,24.99 | v80.26,16.46 v69.49,27.23 63.8,32.92 v62.18,32.92 | v33.73,19.51 33.93,19.51 38.81,24.38 | v55.88,41.45 56.9,40.44 56.9,34.14
  Bottom 0.254: v57.1,33.93 56.9,34.14 | 38.81,24.38 v39.01,24.38
USBP3
  Top 0.203: U4.3 10.57,22.66 X2.3
  Top 0.254: U4.3 12.91,24.99
V+  (via drill 0.38)
  Top 0.61: 91.44,54.46 SJ4.1
  Top 1.016: IC2.3 84.9,32.82 C32.+ 76.45,30.72 IC1.3 | v58.12,56.29 61.57,56.29 v62.79,55.07 | v89.41,48.16 91.04,49.79 C28.1 C31.2 91.04,54.06 91.44,54.46
  Bottom 1.016: IC2.3 88.29,32.82 85.95,35.15 85.95,42.27 89.41,45.72 v89.41,48.16 85.34,52.22 65.63,52.22 v62.79,55.07 | v58.12,56.29 48.56,56.29 46.33,58.52 46.33,59.94 47.14,60.76 47.14,61.77
  pour Bottom (no thermals): 49.38,62.79 46.33,62.79 46.33,61.16 49.38,61.16

### Text on the board
Bottom: Designed By Evan Teitelman and Warren D Greenway | CC-BY-SA
Dimension: TEST >
_tsilk: 5V | VIN | Reset | 5V | 3.3V
_bsilk: BATT | T0 | T1 | T2 | T3 | T4 | T5 | T6 | T7 | T8 | T9 | T10 | T11 | T12 | T13 | T14 | D0 | BATT | D1 | D2 | D3 | D4 | D5 | D6 | D7 | D8 | D9 | D10 | D11 | D12 | D13 | D14 | D15 | D16 | Designed By Evan Teitelman and Warren D Greenway | CC-BY-SA | USB Disc | BOOT1 | BOOT0 | JTRST | DAC1 | JTDO | JTCK | JTMS | JTDI | TA11 | TA10 | DAC2 | RX3 | TX3 | RX2 | TX2 | RX1 | TX1 | MCO | TA9 | TA8 | TA7 | TA6 | TA5 | TA4 | TA3 | TA2 | TA1 | TA0 | SA | D+ | D-